# EasyEDA Pro project 天空星拓展板.eprj

# Schematic Schematic1
Board Name: Board1; Create Date: 2025-07-18; Page Name: P1; Project Name: 天空星拓展板; Schematic Name: Schematic1; Update Date: 2025-07-18; Company: 嘉立创EDA; Page Size: A4; Version: V1.0
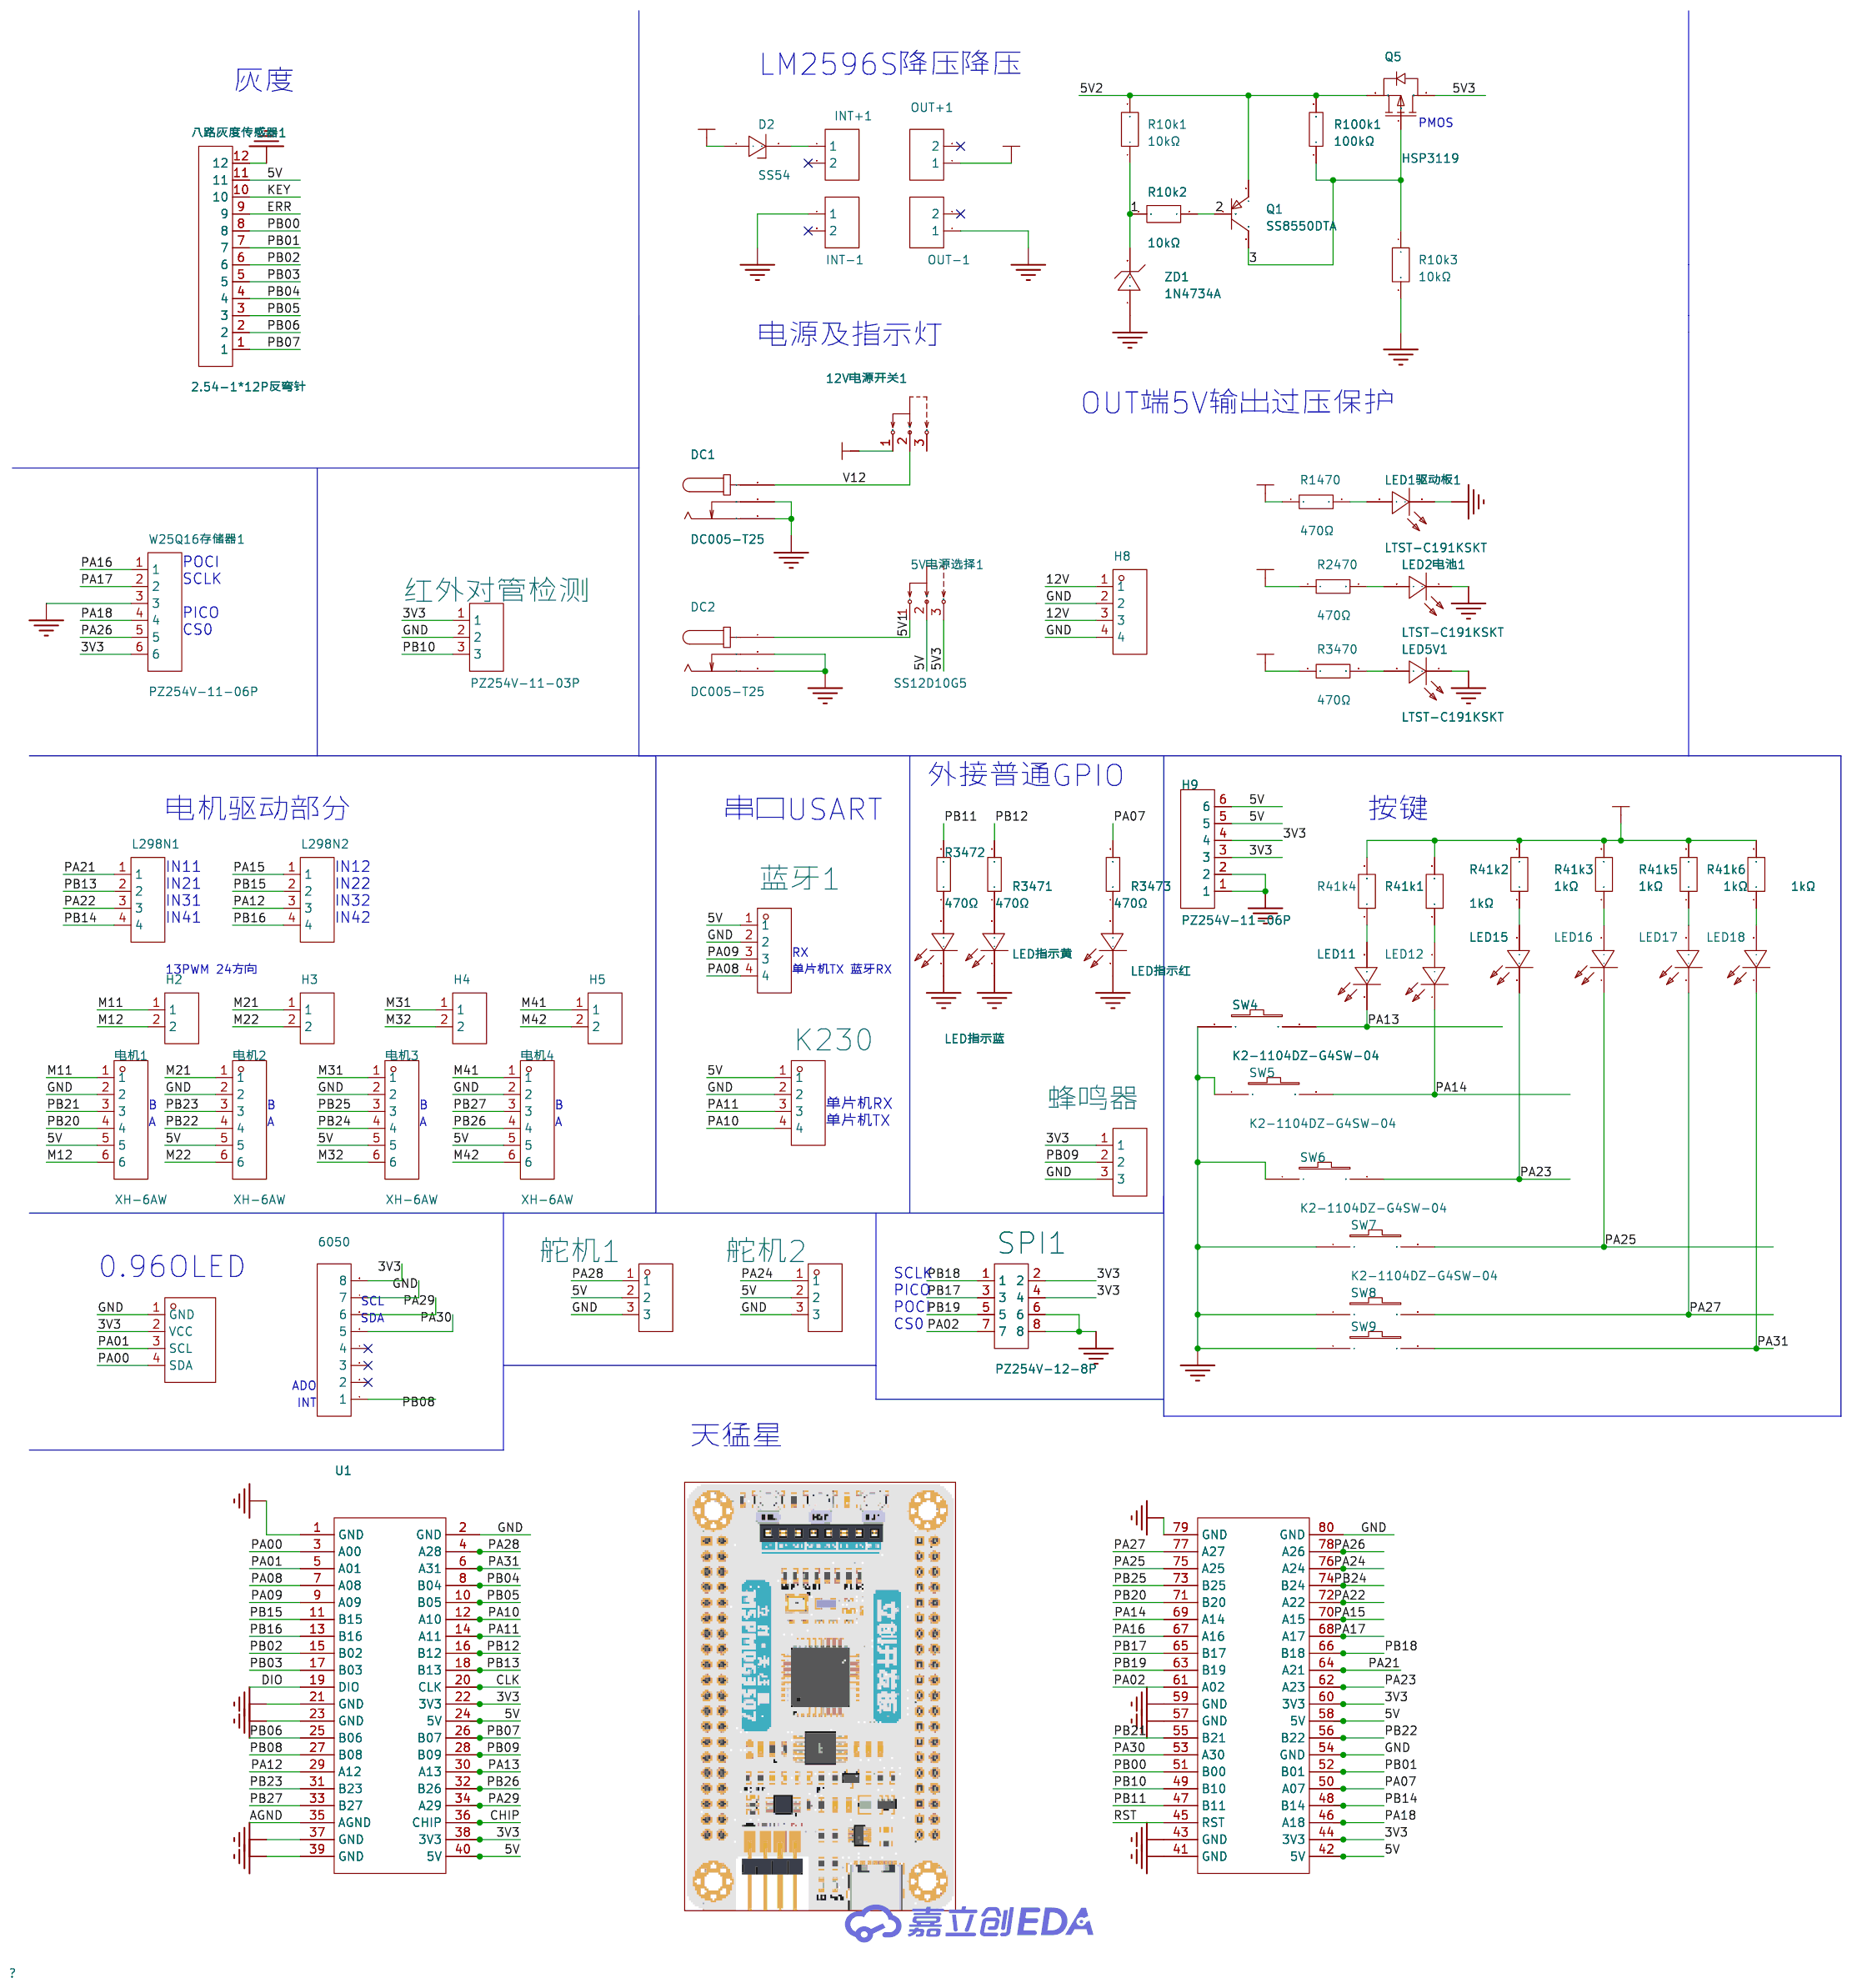
[diagram p0: schematic sheet]

## Parts
5V电源选择1  SS12D10G5  [SW-TH_SHOU-HAN_SS12D10G4]
12V电源开关1  SS12D10G5  [SW-TH_SHOU-HAN_SS12D10G4]
6050  2.54-1*8P母环保  [HDR-TH_8P-P2.54-V-F-1]
D2  SS54  [SMA_L4.3-W2.6-LS5.0-FD]
DC1  DC005-T25  [DC-IN-TH_DC-005-20A-1]
DC2  DC005-T25  [DC-IN-TH_DC-005-20A-1]
H2  PZ254V-11-02P  [HDR-TH_2P-P2.54-V-M]
H3  PZ254V-11-02P  [HDR-TH_2P-P2.54-V-M]
H4  PZ254V-11-02P  [HDR-TH_2P-P2.54-V-M]
H5  PZ254V-11-02P  [HDR-TH_2P-P2.54-V-M]
H8  PZ254V-11-04P  [HDR-TH_4P-P2.54-V-M]
H9  PZ254V-11-06P  [HDR-TH_6P-P2.54-V-M]
INT+1  2.54-1*2P母  [HDR-TH_2P-P2.54-V-F]
INT-1  2.54-1*2P母  [HDR-TH_2P-P2.54-V-F]
K230  PZ254V-11-04P  [HDR-TH_4P-P2.54-V-M]
L298N1  2.54-1*4  [HDR-TH_4P-P2.54-V-M-1]
L298N2  2.54-1*4  [HDR-TH_4P-P2.54-V-M-1]
LED1驱动板1  LTST-C191KSKT  [LED0603-RD-YELLOW]
LED2电池1  LTST-C191KSKT  [LED0603-RD-YELLOW]
LED5V1  LTST-C191KSKT  [LED0603-RD-YELLOW]
LED11  LTST-C191KSKT  [LED0603-RD-YELLOW]
LED12  LTST-C191KSKT  [LED0603-RD-YELLOW]
LED15  LTST-C191KSKT  [LED0603-RD-YELLOW]
LED16  LTST-C191KSKT  [LED0603-RD-YELLOW]
LED17  LTST-C191KSKT  [LED0603-RD-YELLOW]
LED18  LTST-C191KSKT  [LED0603-RD-YELLOW]
LED指示红  LTST-C191KSKT  [LED0603-RD-YELLOW]
LED指示蓝  LTST-C191KSKT  [LED0603-RD-YELLOW]
LED指示黄  LTST-C191KSKT  [LED0603-RD-YELLOW]
OLED1  HS96L03W2C03  [OLED-TH_L27.8-W27.2-P2.54_C9900033791]
OUT+1  2.54-1*2P母  [HDR-TH_2P-P2.54-V-F]
OUT-1  2.54-1*2P母  [HDR-TH_2P-P2.54-V-F]
Q1  SS8550DTA  [TO-92-3_L4.8-W3.7-P2.54-L]
Q5  HSP3119  [TO-220-3_L10.2-W4.5-P2.54-L-1]
R10k1  10kΩ  [RES-TH_BD2.4-L6.3-P10.30-D0.6]
R10k2  10kΩ  [RES-TH_BD2.4-L6.3-P10.30-D0.6]
R10k3  10kΩ  [RES-TH_BD2.4-L6.3-P10.30-D0.6]
R41k1  1kΩ  [R0603]
R41k2  1kΩ  [R0603]
R41k3  1kΩ  [R0603]
R41k4  1kΩ  [R0603]
R41k5  1kΩ  [R0603]
R41k6  1kΩ  [R0603]
R100k1  100kΩ  [RES-TH_BD2.7-L6.2-P10.20-D0.4]
R1470  470Ω  [R0603]
R2470  470Ω  [R0603]
R3470  470Ω  [R0603]
R3471  470Ω  [R0603]
R3472  470Ω  [R0603]
R3473  470Ω  [R0603]
SPI1  PZ254V-12-8P  [HDR-TH_8P-P2.54-V-M-R2-C4-S2.54]
SW4  K2-1104DZ-G4SW-04  [KEY-TH_2P-L6.0-W6.0-P5.00]
SW5  K2-1104DZ-G4SW-04  [KEY-TH_2P-L6.0-W6.0-P5.00]
SW6  K2-1104DZ-G4SW-04  [KEY-TH_2P-L6.0-W6.0-P5.00]
SW7  K2-1104DZ-G4SW-04  [KEY-TH_2P-L6.0-W6.0-P5.00]
SW8  K2-1104DZ-G4SW-04  [KEY-TH_2P-L6.0-W6.0-P5.00]
SW9  K2-1104DZ-G4SW-04  [KEY-TH_2P-L6.0-W6.0-P5.00]
U1  LCKFB-TMX-MSPM0G3507  [COMM-TH_LCKFB-TMX-MSPM0G3507]
W25Q16存储器1  PZ254V-11-06P  [HDR-TH_6P-P2.54-V-M]
ZD1  1N4734A  [DO-41_BD2.8-L4.2-P8.00-D0.7-FD]
八路灰度传感器1  2.54-1*12P反弯针  [HDR-TH_12P-P2.54-H-M-W10.5]
电机1  XH-6AW  [CONN-TH_6P-P2.54_HCTL_XH-6AW_C2908615]
电机2  XH-6AW  [CONN-TH_6P-P2.54_HCTL_XH-6AW_C2908615]
电机3  XH-6AW  [CONN-TH_6P-P2.54_HCTL_XH-6AW_C2908615]
电机4  XH-6AW  [CONN-TH_6P-P2.54_HCTL_XH-6AW_C2908615]
红外对管检测  PZ254V-11-03P  [HDR-TH_3P-P2.54-V-M]
舵机1  舵机  [HDR-TH_3P-P2.54-V-F]
舵机2  舵机  [HDR-TH_3P-P2.54-V-F]
蓝牙1  2.54-1*4P母  [HDR-TH_4P-P2.54-V-F]
蜂鸣器  PZ254V-11-03P  [HDR-TH_3P-P2.54-V-M]

## Library data of the parts
5V电源选择1 12V电源开关1 = SS12D10G5: 电路结构:单刀双掷;安装方式:直插;额定电流(DC):2A;额定电压(DC):125V;机械寿命:3千次;; LCSC Part Name: 两档立式插件 3脚拨动开关 柄长5.0mm; Supplier Part: C7431054; Manufacturer: SHOU HAN(首韩); Supplier Footprint: 插件; JLCPCB Part Class: 扩展库; Datasheet: https://atta.szlcsc.com/upload/public/pdf/source/20231130/7A3DB6A149BF0A1DCFFE64FFC07FE434.pdf; Supplier: LCSC; Circuit: 单刀双掷; Switch Length: 12.7mm; Switch Width: 6.7mm; Mounting Style: 直插; Current Rating (DC): 2A; Voltage Rating (DC): 125V; Mechanical Life: 3千次; Operating Temperature: -25℃~+70℃
6050 = 2.54-1*8P母环保: 插孔结构:1x8P;间距:2.54mm;行距:-;安装类型:直插;排数:单排;总孔位数:8P;塑高:-;触头材质:-;触头镀层:-;; LCSC Part Name: 间距:2.54mm 1x8P 直插; Supplier Part: C27438; Manufacturer: BOOMELE(博穆精密); Supplier Footprint: 插件,P=2.54mm; JLCPCB Part Class: 扩展库; Datasheet: https://atta.szlcsc.com/upload/public/pdf/source/20231221/1CA800C6799ED97958773716FAA1BFFE.pdf; Supplier: LCSC; Holes Structure: 1x8P; Pitch: 2.54mm; Mounting Type: 直插; Number of Rows: 单排; Number of Holes: 8P
D2 = SS54_C7420369: 二极管配置:独立式;正向压降(Vf):550mV@5.0A;直流反向耐压(Vr):40V;整流电流:5A;; LCSC Part Name: 电压:40V 电流:5A; Supplier Part: C7420369; Manufacturer: 宏迦橙; Supplier Footprint: SMA(DO-214AC); JLCPCB Part Class: 扩展库; Datasheet: https://atta.szlcsc.com/upload/public/pdf/source/20230828/254C3882F8647358AD9F60DD73611B5E.pdf; Supplier: LCSC; Diode Configuration: 独立式; Forward Voltage (Vf@If): 550mV@5.0A; Reverse Voltage (Vr): 40V; Rectified Current: 5A; Reverse Leakage Current (Ir): 50uA@40V
DC1 DC2 = DC005-T25: 触点内径:2.5mm;触点外径:6.3mm;额定电流:-;额定电压:-;; LCSC Part Name: 内径:2.5mm 外径:6.3mm; Supplier Part: C111573; Manufacturer: SOFNG(硕方); Supplier Footprint: 插件; JLCPCB Part Class: 扩展库; Datasheet: https://atta.szlcsc.com/upload/public/pdf/source/20211217/AAF92010038535095742900872F779AE.pdf; Supplier: LCSC; Inside Contact Diameter: 2.5mm; Outside Contact Diameter: 6.3mm
H2-H5 = PZ254V-11-02P: 插针结构:1x2P;间距:2.54mm;行距:-;圆针/方针:方针;安装方式:直插;排数:单排;总PIN位数:2P;额定电流:-;额定电压:-;配合针长度:6mm;塑高:2.5mm;端接针长度:3mm;触头材质:黄铜;触头镀层:-;工作温度:-40℃~+105℃;颜色:黑色;; LCSC Part Name: 1x2P 间距:2.54mm 方针 直插; Supplier Part: C492401; Manufacturer: XFCN(兴飞); Supplier Footprint: 插件,P=2.54mm; JLCPCB Part Class: 扩展库; Datasheet: https://atta.szlcsc.com/upload/public/pdf/source/20200309/C492401_A812433581A9B211A7FFA413ADDFF0E5.pdf; Supplier: LCSC; Pin Structure: 1x2P; Pitch: 2.54mm; Circluar Pins/Square Pins: 方针; Mounting Type: 直插; Number of Rows: 单排; Number of Pins: 2P; Length of Mating Pin: 6mm; Insulation Height: 2.5mm; Length of End Connection Pin: 3mm; Contact Material: 黄铜; Operating Temperature: -40℃~+105℃; Color: 黑色
H8 K230 = PZ254V-11-04P: 插针结构:1x4P;间距:2.54mm;行距:-;圆针/方针:方针;安装类型:直插;排数:单排;总PIN位数:4P;额定电流:3A;额定电压:250V;配合针长度:6mm;塑高:2.5mm;端接针长度:3mm;触头材质:-;工作温度范围:-40℃~+105℃;颜色:黑色;; LCSC Part Name: 间距:2.54mm 1x4P 直插 方针; Supplier Part: C2691448; Manufacturer: XFCN(兴飞); Supplier Footprint: 插件,P=2.54mm; JLCPCB Part Class: 扩展库; Datasheet: https://atta.szlcsc.com/upload/public/pdf/source/20200309/C492403_F9F19131791D08044AD4F84F8E751A34.pdf; Supplier: LCSC; Pin Structure: 1x4P; Pitch: 2.54mm; Circluar Pins/Square Pins: 方针; Mounting Type: 直插; Number of Rows: 单排; Number of Pins: 4P; Current Rating (Max): 3A; Voltage Rating (Max): 250V; Length of Mating Pin: 6mm; Insulation Height: 2.5mm; Length of End Connection Pin: 3mm; Operating Temperature Range: -40℃~+105℃; Color: 黑色
H9 W25Q16存储器1 = PZ254V-11-06P: 插针结构:1x6P;间距:2.54mm;行距:-;圆针/方针:方针;安装方式:直插;排数:单排;总PIN位数:6P;额定电流:-;额定电压:-;配合针长度:6mm;塑高:2.5mm;端接针长度:3mm;触头材质:黄铜;触头镀层:-;工作温度:-40℃~+105℃;颜色:黑色;; LCSC Part Name: 1x6P 间距:2.54mm 方针 直插; Supplier Part: C492405; Manufacturer: XFCN(兴飞); Supplier Footprint: 插件,P=2.54mm; JLCPCB Part Class: 扩展库; Datasheet: https://atta.szlcsc.com/upload/public/pdf/source/20200309/C492405_597F1930F5B55CC3C7FD95458F1C3977.pdf; Supplier: LCSC; Pin Structure: 1x6P; Pitch: 2.54mm; Circluar Pins/Square Pins: 方针; Mounting Type: 直插; Number of Rows: 单排; Number of Pins: 6P; Length of Mating Pin: 6mm; Insulation Height: 2.5mm; Length of End Connection Pin: 3mm; Contact Material: 黄铜; Operating Temperature: -40℃~+105℃; Color: 黑色
INT+1 INT-1 OUT+1 OUT-1 = 2.54-1*2P母: 插孔结构:1x2P;间距:2.54mm;行距:-;安装类型:直插;排数:单排;总孔位数:2P;塑高:-;触头材质:-;触头镀层:-;; LCSC Part Name: 间距:2.54mm 1x2P 直插; Supplier Part: C49661; Manufacturer: BOOMELE(博穆精密); Supplier Footprint: 插件,P=2.54mm; JLCPCB Part Class: 扩展库; Datasheet: https://atta.szlcsc.com/upload/public/pdf/source/20210301/C2718488_F4427B881E42CAA8DDB0B1C12B3A522C.pdf; Supplier: LCSC; Holes Structure: 1x2P; Pitch: 2.54mm; Mounting Type: 直插; Number of Rows: 单排; Number of Holes: 2P
L298N1 L298N2 = 2.54-1*4: 插针结构:1x4P;间距:2.54mm;排数:单排;总PIN位数:4P;; Supplier Part: C5116483; Manufacturer: ZHOURI(洲日); Supplier Footprint: 插件,P=2.54mm; JLCPCB Part Class: 扩展库; Datasheet: https://atta.szlcsc.com/upload/public/pdf/source/20250227/F941FC765EF241ABFB2D5D72948A31A5.pdf; Supplier: LCSC; Pin Structure: 1x4P; Pitch: 2.54mm; Number of Rows: 单排; Number of Pins: 4P
LED1驱动板1 LED2电池1 LED5V1 LED11 LED12 LED15-LED18 LED指示红 LED指示蓝 LED指示黄 = LTST-C191KSKT: 发光颜色:黄色;正向电压(VF):2.1V;功率:75mW;正向电流:20mA;主波长:584.5nm~597nm;二极管配置:-;透镜颜色:无色透明透镜;色温:-;发光强度:104mcd;发光角度:130°;载带方式:-;工作温度:-55℃~+85℃;; LCSC Part Name: 黄灯; Supplier Part: C125100; Manufacturer: LITEON(光宝); Supplier Footprint: 0603; JLCPCB Part Class: 扩展库; Datasheet: https://atta.szlcsc.com/upload/public/pdf/source/20180129/C125100_15171877314981315871.pdf; Supplier: LCSC; Emitted Color: 黄色; Forward Voltage (VF): 2.1V; Power Dissipation: 75mW; Forward Current: 20mA; Dominant Wavelength: 584.5nm~597nm; Peak Wavelength: 588nm; Lens Color: 无色透明透镜; Luminous Intensity: 104mcd; Viewing Angle: 130°; Operating Temperature: -55℃~+85℃
OLED1 = HS96L03W2C03: 主控芯片:SSD1315;接口类型:I2C;尺寸(inch):0.96;像素分辨率:128x64;; LCSC Part Name: 0.96寸OLED显示屏窄白光IIC; Supplier Part: C5248080; Manufacturer: HS(汉昇); JLCPCB Part Class: 扩展库; Datasheet: https://atta.szlcsc.com/upload/public/pdf/source/20230627/763D01F79A90007632F098068C7C8AD9.pdf; Supplier: LCSC; Main Control Chip: SSD1315; Interface Type: I2C; Size: 0.96; Pixel Resolution: 128x64; Operating Temperature: -40℃~+70℃
Q1 = SS8550DTA: 晶体管类型:PNP;集电极电流(Ic):1.5A;集射极击穿电压(Vceo):25V;功率(Pd):2W;直流电流增益(hFE@Ic,Vce):40@800mA,1V;; LCSC Part Name: PNP 电流:1.5A 耐压:25V; Supplier Part: C903228; Manufacturer: onsemi(安森美); Supplier Footprint: TO-92-3; JLCPCB Part Class: Extended Part; Datasheet: https://atta.szlcsc.com/upload/public/pdf/source/20221020/9DBCD1C6A257D06DE4F9043ED0140297.pdf; Supplier: LCSC; Transistor Type: PNP; Collector Current (Ic): 1.5A; Collector-Emitter Breakdown Voltage (Vceo): 25V; Power Dissipation (Pd): 2W; DC Current Gain (hFE@Ic,Vce): 40@800mA,1V; Transition Frequency (fT): 100MHz; Collector Cut-Off Current (Icbo): 100nA; Collector-Emitter Saturation Voltage (VCE(sat)@Ic,Ib): 280mV@800mA,80mA; Operating Temperature: -65℃~+150℃
Q5 = HSP3119: 类型:1个P沟道;漏源电压(Vdss):30V;连续漏极电流(Id):150A;导通电阻(RDS(on)):-;耗散功率(Pd):200W;阈值电压(Vgs(th)):2.5V;; LCSC Part Name: 1个P沟道 耐压:30V 电流:150A; Supplier Part: C22359262; Manufacturer: HUASHUO(华朔); Supplier Footprint: TO-220; JLCPCB Part Class: Extended Part; Datasheet: https://atta.szlcsc.com/upload/public/pdf/source/20240313/B2043F85A28365E5AF5F107A9C9B0F2E.pdf; Supplier: LCSC; Type: 1个P沟道; Drain to Source Voltage: 30V; Current - Continuous Drain(Id): 150A; Pd - Power Dissipation: 200W; Gate Threshold Voltage (Vgs(th)@Id): 2.5V; Input Capacitance(Ciss@Vds): 12.7nF@15V; Reverse Transfer Capacitance (Crss@Vds): 1.21nF@15V; Operating Temperature: -55℃~+150℃@(Tj)
R10k1-R10k3 = RN1/4W10KFT/BA1: 电阻类型:金属膜电阻;阻值:10kΩ;精度:±1%;功率:250mW;温度系数:±50ppm/℃;; LCSC Part Name: 10kΩ ±1% 250mW 金属膜电阻; Supplier Part: C410695; Manufacturer: Tyohm(幸亚电阻); Supplier Footprint: 插件,D2.4xL6.5mm; JLCPCB Part Class: Extended Part; Datasheet: https://atta.szlcsc.com/upload/public/pdf/source/20190808/C410699_D126E64D28B638F1D73B58E9F61DFD9B.pdf; Supplier: LCSC; Type: 金属膜电阻; Tolerance: ±1%; Overload Voltage (Max): 250V; Power(Watts): 250mW; Temperature Coefficient: ±50ppm/℃; Operating Temperature Range: -55℃~+125℃
R41k1-R41k6 = FCR0603F1K: 电阻类型:厚膜电阻;阻值:1kΩ;精度:±1%;功率:100mW;最大工作电压:75V;; LCSC Part Name: 1K ±1%; Supplier Part: C5913168; Manufacturer: VO(翔胜); Supplier Footprint: 0603; JLCPCB Part Class: 扩展库; Datasheet: https://atta.szlcsc.com/upload/public/pdf/source/20230428/98B65D379E9BA4CF2A9223D1647B01B6.pdf; Supplier: LCSC; Type: 厚膜电阻; Tolerance: ±1%; Power(Watts): 100mW; Overload Voltage (Max): 75V; Operating Temperature Range: -55℃~+155℃
R100k1 = MF1/4W-100K±1%-OT26: 电阻类型:金属膜电阻;阻值:100kΩ;精度:±1%;功率:250mW;温度系数:±350ppm/℃;; LCSC Part Name: 金属膜电阻 100kΩ ±1% 250mW; Supplier Part: C2843019; Manufacturer: VO(翔胜); Supplier Footprint: 插件,D2.7xL6.2mm; JLCPCB Part Class: Extended Part; Datasheet: https://atta.szlcsc.com/upload/public/pdf/source/20200609/C601728_5AA4C0C8E12E11069DA2C3356F29D1F2.pdf; Supplier: LCSC; Type: 金属膜电阻; Tolerance: ±1%; Overload Voltage (Max): 250V; Power(Watts): 250mW; Temperature Coefficient: ±350ppm/℃; Operating Temperature Range: -55℃~+155℃
R1470 R2470 R3470-R3473 = 0603WAF4700T5E: 电阻类型:厚膜电阻;阻值:470Ω;精度:±1%;功率:100mW;最大工作电压:75V;温度系数:±100ppm/℃;; LCSC Part Name: 470Ω ±1% 100mW 厚膜电阻; Supplier Part: C23179; Manufacturer: UNI-ROYAL(厚声); Supplier Footprint: 0603; JLCPCB Part Class: 基础库; Datasheet: https://atta.szlcsc.com/upload/public/pdf/source/20200306/C422600_1E6D84923E4A46A82E41ADD87F860B5C.pdf; Supplier: LCSC; Type: 厚膜电阻; Tolerance: ±1%; Power(Watts): 100mW; Overload Voltage (Max): 75V; Temperature Coefficient: ±100ppm/℃; Operating Temperature Range: -55℃~+155℃
SPI1 = PZ254V-12-8P: 插针结构:2x4P;间距:2.54mm;行距:2.54mm;圆针/方针:方针;安装方式:直插;排数:双排;总PIN位数:8P;额定电流:-;额定电压:-;配合针长度:6mm;塑高:2.5mm;端接针长度:3mm;触头材质:黄铜;触头镀层:-;工作温度:-40℃~+105℃;颜色:黑色;; LCSC Part Name: 2x4P 间距:2.54mm 方针 直插; Supplier Part: C492421; Manufacturer: XFCN(兴飞); Supplier Footprint: 插件,P=2.54mm; JLCPCB Part Class: 扩展库; Datasheet: https://atta.szlcsc.com/upload/public/pdf/source/20200309/C492421_DC8A206AF99CD7755BD4A5B0BC48200B.pdf; Supplier: LCSC; Pin Structure: 2x4P; Pitch: 2.54mm; Row Spacing: 2.54mm; Circluar Pins/Square Pins: 方针; Mounting Type: 直插; Number of Rows: 双排; Number of Pins: 8P; Length of Mating Pin: 6mm; Insulation Height: 2.5mm; Length of End Connection Pin: 3mm; Contact Material: 黄铜; Operating Temperature: -40℃~+105℃; Color: 黑色
SW4-SW9 = K2-1104DZ-G4SW-04: 作用力:250gf;安装方式:直插;开关长度:6mm;开关宽度:6mm;开关高度:7mm;触点电流:50mA;额定电压(DC):12V;绝缘电阻:100MΩ;机械寿命:10万次;; LCSC Part Name: 6*6*7 两脚长脚开关; Supplier Part: C961736; Manufacturer: 韩国韩荣; Supplier Footprint: 插件; JLCPCB Part Class: 扩展库; Datasheet: https://atta.szlcsc.com/upload/public/pdf/source/20201126/C961736_4F85C6E6E5B3656D5DC7C0B00D034F4A.pdf; Supplier: LCSC; Operating Force: 250gf; Mounting Style: 直插; Switch Length: 6mm; Switch Width: 6mm; Switch Height: 7mm; Contact Current: 50mA; Voltage Rating (DC): 12V; Insulation Resistance: 100MΩ; Mechanical Life: 10万次; Operating Temperature: -25℃~+85℃
U1 = LCKFB-TMX-MSPM0G3507: LCSC Part Name: 5件套 立创·天猛星MSPM0G3507开发板; Supplier Part: C42378531; Manufacturer: 立创开发板; Datasheet: https://atta.szlcsc.com/upload/public/pdf/source/20241209/800332349277522348D9357AB5109808.pdf; Supplier: LCSC
ZD1 = 1N4734A_C41430: 二极管配置:独立式;稳压值(标称值):5.6V;耗散功率(Pd):-;; LCSC Part Name: 编带 1N4734A; Supplier Part: C41430; Manufacturer: ST(先科); Supplier Footprint: DO-41; JLCPCB Part Class: Extended Part; Datasheet: https://atta.szlcsc.com/upload/public/pdf/source/20170719/C118641_1500457766301828347.pdf; Supplier: LCSC; Diode Configuration: 独立式; Zener Voltage(Nom): 5.6V; Reverse Leakage Current (Ir): 10uA@2V; Impedance(Zzt): 5Ω
八路灰度传感器1 = 2.54-1*12P反弯针_C725243: 插针结构:1x12P;间距:2.54mm;行距:-;圆针/方针:方针;安装方式:弯插;排数:单排;总PIN位数:12P;额定电流:3A;额定电压:-;配合针长度:6mm;塑高:-;端接针长度:-;触头材质:-;工作温度:-55℃~+105℃;颜色:黑色;; LCSC Part Name: 1x12P 间距:2.54mm 方针 弯插; Supplier Part: C725243; Manufacturer: BOOMELE(博穆精密); Supplier Footprint: 弯插,P=2.54mm; JLCPCB Part Class: 扩展库; Datasheet: https://atta.szlcsc.com/upload/public/pdf/source/20190508/C74252_03DDEC4696EE17172E44B96636392962.pdf; Supplier: LCSC; Pin Structure: 1x12P; Pitch: 2.54mm; Circluar Pins/Square Pins: 方针; Mounting Type: 弯插; Number of Rows: 单排; Number of Pins: 12P; Current Rating: 3A; Length of Mating Pin: 6mm; Operating Temperature: -55℃~+105℃; Color: 黑色
电机1-电机4 = XH-6AW: 插针结构:1x6P;间距:2.5mm;安装方式:弯插;参考系列:XH;总PIN数:6P;排数:1;每排PIN数:6;行距:-;额定电流:3A;触头材质:黄铜;触头镀层:锡;工作温度范围:-25℃~+85℃;; LCSC Part Name: 1x6P 间距:2.5mm 弯插 系列:XH; Supplier Part: C2908615; Manufacturer: HCTL(华灿天禄); Supplier Footprint: 弯插,P=2.5mm; JLCPCB Part Class: 扩展库; Datasheet: https://atta.szlcsc.com/upload/public/pdf/source/20230711/B565BAF3B11666EF6B81B3605408F2BD.pdf; Supplier: LCSC; Pins Structure: 1x6P; Pitch: 2.5mm; Mounting Style: 弯插; Reference Series: XH; Number of Pins: 6P; Number of Rows: 1; Number of PINs Per Row: 6; Current Rating (Max): 3A; Contact Material: 黄铜; Contact Plating: 锡; Operating Temperature Range: -25℃~+85℃
红外对管检测 蜂鸣器 = PZ254V-11-03P: 插针结构:1x3P;间距:2.54mm;行距:-;圆针/方针:方针;安装方式:直插;排数:单排;总PIN位数:3P;额定电流:3A;额定电压:250V;配合针长度:6mm;塑高:2.5mm;端接针长度:3mm;工作温度:-40℃~+105℃;颜色:黑色;; LCSC Part Name: 1x3P 间距:2.54mm 方针 直插; Supplier Part: C2937625; Manufacturer: XFCN(兴飞); Supplier Footprint: 插件,P=2.54mm; JLCPCB Part Class: 扩展库; Datasheet: https://atta.szlcsc.com/upload/public/pdf/source/20200309/C492402_8335C3D49C4E4C618838D59BB1D024C1.pdf; Supplier: LCSC; Pin Structure: 1x3P; Pitch: 2.54mm; Circluar Pins/Square Pins: 方针; Mounting Type: 直插; Number of Rows: 单排; Number of Pins: 3P; Current Rating: 3A; Voltage Rating (Max): 250V; Length of Mating Pin: 6mm; Insulation Height: 2.5mm; Length of End Connection Pin: 3mm; Operating Temperature: -40℃~+105℃; Color: 黑色
舵机1 舵机2 = PM254V-11-03-H85: 插孔结构:1x3P;间距:2.54mm;行距:-;安装类型:直插;排数:单排;总孔位数:3P;塑高:-;触头材质:黄铜;触头镀层:-;; LCSC Part Name: 间距:2.54mm 1x3P 直插; Supplier Part: C541850; Manufacturer: XFCN(兴飞); Supplier Footprint: 插件,P=2.54mm; JLCPCB Part Class: 扩展库; Datasheet: https://atta.szlcsc.com/upload/public/pdf/source/20200518/C541849_85853D71FC67C51915A806977A588FDA.pdf; Supplier: LCSC; Holes Structure: 1x3P; Pitch: 2.54mm; Mounting Type: 直插; Number of Rows: 单排; Number of Holes: 3P; Contact Material: 黄铜
蓝牙1 = 2.54-1*4P母: 插孔结构:1x4P;间距:2.54mm;行距:-;圆孔/方孔:方孔;安装类型:直插;排数:单排;总孔位数:4P;额定电流:3A;额定电压:-;插孔方向:顶部;塑高:-;触头材质:青铜;触头镀层:-;工作温度范围:-40℃~+105℃;焊接温度(最大值):-;; LCSC Part Name: 间距:2.54mm 1x4P 直插; Supplier Part: C2718488; Manufacturer: BOOMELE(博穆精密); Supplier Footprint: 插件,P=2.54mm; JLCPCB Part Class: 扩展库; Datasheet: https://atta.szlcsc.com/upload/public/pdf/source/20210301/C2718488_F4427B881E42CAA8DDB0B1C12B3A522C.pdf; Supplier: LCSC; Holes Structure: 1x4P; Pitch: 2.54mm; Circular Hole / Square Hole: 方孔; Mounting Type: 直插; Number of Rows: 单排; Number of Holes: 4P; Current Rating (Max): 3A; Holes Direction: 顶部; Contact Material: 青铜; Operating Temperature Range: -40℃~+105℃

## Nets
3V3: 6050.8 H9.3 H9.4 OLED1.2(VCC) R41k1.2 R41k2.2 R41k3.2 R41k4.2 R41k5.2 R41k6.2 R2470.1 SPI1.2 SPI1.4 U1.22(3V3) U1.38(3V3) U1.44(3V3) U1.60(3V3) W25Q16存储器1.6 红外对管检测.1 蜂鸣器.1
5V: 5V电源选择1.2 H9.5 H9.6 K230.1 R3470.1 U1.24(5V) U1.40(5V) U1.42(5V) U1.58(5V) 八路灰度传感器1.11 电机1.5 电机2.5 电机3.5 电机4.5 舵机1.2 舵机2.2 蓝牙1.1
5V1: 5V电源选择1.1 DC2.1
5V2: OUT+1.1 Q1.1(E) Q5.3(S) R10k1.2 R100k1.2
5V3: 5V电源选择1.3 Q5.2(D)
12V: 12V电源开关1.1 D2.1(A) H8.1 H8.3 R1470.1
AGND: U1.35(AGND)
GND: 6050.7 DC1.2 DC1.3 DC2.2 DC2.3 H8.2 H8.4 H9.1 H9.2 INT-1.1 K230.2 LED1驱动板1.1(-) LED2电池1.1(-) LED5V1.1(-) LED指示红.1(-) LED指示蓝.1(-) LED指示黄.1(-) OLED1.1(GND) OUT-1.1 R10k3.2 SPI1.6 SPI1.8 SW4.1 SW5.1 SW6.1 SW7.1 SW8.1 SW9.1 U1.1(GND) U1.2(GND) U1.21(GND) U1.23(GND) U1.37(GND) U1.39(GND) U1.41(GND) U1.43(GND) U1.54(GND) U1.57(GND) U1.59(GND) U1.79(GND) U1.80(GND) W25Q16存储器1.3 ZD1.1(A) 八路灰度传感器1.12 电机1.2 电机2.2 电机3.2 电机4.2 红外对管检测.2 舵机1.3 舵机2.3 蓝牙1.2 蜂鸣器.3
V12: 12V电源开关1.2 DC1.1
1: R10k1.1 R10k2.2 ZD1.2(K)
2: Q1.2(B) R10k2.1
3: Q1.3(C) Q5.1(G) R10k3.1 R100k1.1
CHIP: U1.36(CHIP)
CLK: U1.20(CLK)
DIO: U1.19(DIO)
ERR: 八路灰度传感器1.9
KEY: 八路灰度传感器1.10
M11: H2.1 电机1.1
M12: H2.2 电机1.6
M21: H3.1 电机2.1
M22: H3.2 电机2.6
M31: H4.1 电机3.1
M32: H4.2 电机3.6
M41: H5.1 电机4.1
M42: H5.2 电机4.6
PA00: OLED1.4(SDA) U1.3(A00)
PA01: OLED1.3(SCL) U1.5(A01)
PA02: SPI1.7 U1.61(A02)
PA07: R3473.2 U1.50(A07)
PA08: U1.7(A08) 蓝牙1.4
PA09: U1.9(A09) 蓝牙1.3
PA10: K230.4 U1.12(A10)
PA11: K230.3 U1.14(A11)
PA12: L298N2.3 U1.29(A12)
PA13: LED11.1(-) SW4.2 U1.30(A13)
PA14: LED12.1(-) SW5.2 U1.69(A14)
PA15: L298N2.1 U1.70(A15)
PA16: U1.67(A16) W25Q16存储器1.1
PA17: U1.68(A17) W25Q16存储器1.2
PA18: U1.46(A18) W25Q16存储器1.4
PA21: L298N1.1 U1.64(A21)
PA22: L298N1.3 U1.72(A22)
PA23: LED15.1(-) SW6.2 U1.62(A23)
PA24: U1.76(A24) 舵机2.1
PA25: LED16.1(-) SW7.2 U1.75(A25)
PA26: U1.78(A26) W25Q16存储器1.5
PA27: LED17.1(-) SW8.2 U1.77(A27)
PA28: U1.4(A28) 舵机1.1
PA29: 6050.6 U1.34(A29)
PA30: 6050.5 U1.53(A30)
PA31: LED18.1(-) SW9.2 U1.6(A31)
PB00: U1.51(B00) 八路灰度传感器1.8
PB01: U1.52(B01) 八路灰度传感器1.7
PB02: U1.15(B02) 八路灰度传感器1.6
PB03: U1.17(B03) 八路灰度传感器1.5
PB04: U1.8(B04) 八路灰度传感器1.4
PB05: U1.10(B05) 八路灰度传感器1.3
PB06: U1.25(B06) 八路灰度传感器1.2
PB07: U1.26(B07) 八路灰度传感器1.1
PB08: 6050.1 U1.27(B08)
PB09: U1.28(B09) 蜂鸣器.2
PB10: U1.49(B10) 红外对管检测.3
PB11: R3472.2 U1.47(B11)
PB12: R3471.2 U1.16(B12)
PB13: L298N1.2 U1.18(B13)
PB14: L298N1.4 U1.48(B14)
PB15: L298N2.2 U1.11(B15)
PB16: L298N2.4 U1.13(B16)
PB17: SPI1.3 U1.65(B17)
PB18: SPI1.1 U1.66(B18)
PB19: SPI1.5 U1.63(B19)
PB20: U1.71(B20) 电机1.4
PB21: U1.55(B21) 电机1.3
PB22: U1.56(B22) 电机2.4
PB23: U1.31(B23) 电机2.3
PB24: U1.74(B24) 电机3.4
PB25: U1.73(B25) 电机3.3
PB26: U1.32(B26) 电机4.4
PB27: U1.33(B27) 电机4.3
RST: U1.45(RST)
$1N2882: LED5V1.2(+) R3470.2
$1N2893: LED1驱动板1.2(+) R1470.2
$1N2924: LED2电池1.2(+) R2470.2
$1N2928: D2.2(K) INT+1.1
$1N4920: LED11.2(+) R41k4.1
$1N4923: LED12.2(+) R41k1.1
$1N4924: LED15.2(+) R41k2.1
$1N4925: LED16.2(+) R41k3.1
$1N4935: LED17.2(+) R41k5.1
$1N4936: LED18.2(+) R41k6.1
$1N7306: LED指示黄.2(+) R3471.1
$1N7461: LED指示蓝.2(+) R3472.1
$1N7683: LED指示红.2(+) R3473.1

Not connected (* = marked no-connect by the designer): 12V电源开关1 3; 6050 2* 3* 4*; INT+1 2*; INT-1 2*; OUT+1 2*; OUT-1 2*

## Notes on the sheet
- LM2596S降压降压
- 灰度
- PMOS
- 电源及指示灯
- OUT端5V输出过压保护
- POCI
- SCLK
- PICO
- CS0
- 外接普通GPIO
- 电机驱动部分
- 串口USART
- 按键
- IN11
- IN12
- IN21
- IN22
- IN31
- IN32
- IN41
- IN42
- RX
- 13PWM 24方向
- 单片机TX 蓝牙RX
- B
- B
- B
- B
- 单片机RX
- A
- A
- A
- A
- 单片机TX
- 0.96OLED
- SCL
- PICO
- SCLK
- SDA
- POCI
- CS0
- ADO
- INT
- 天猛星

# Schematic Schematic3
Board Name: Board2; Create Date: 2025-07-18; Page Name: P1; Project Name: 天空星拓展板; Schematic Name: Schematic3; Update Date: 2025-07-18; Company: 嘉立创EDA; Page Size: A4; Version: V1.0
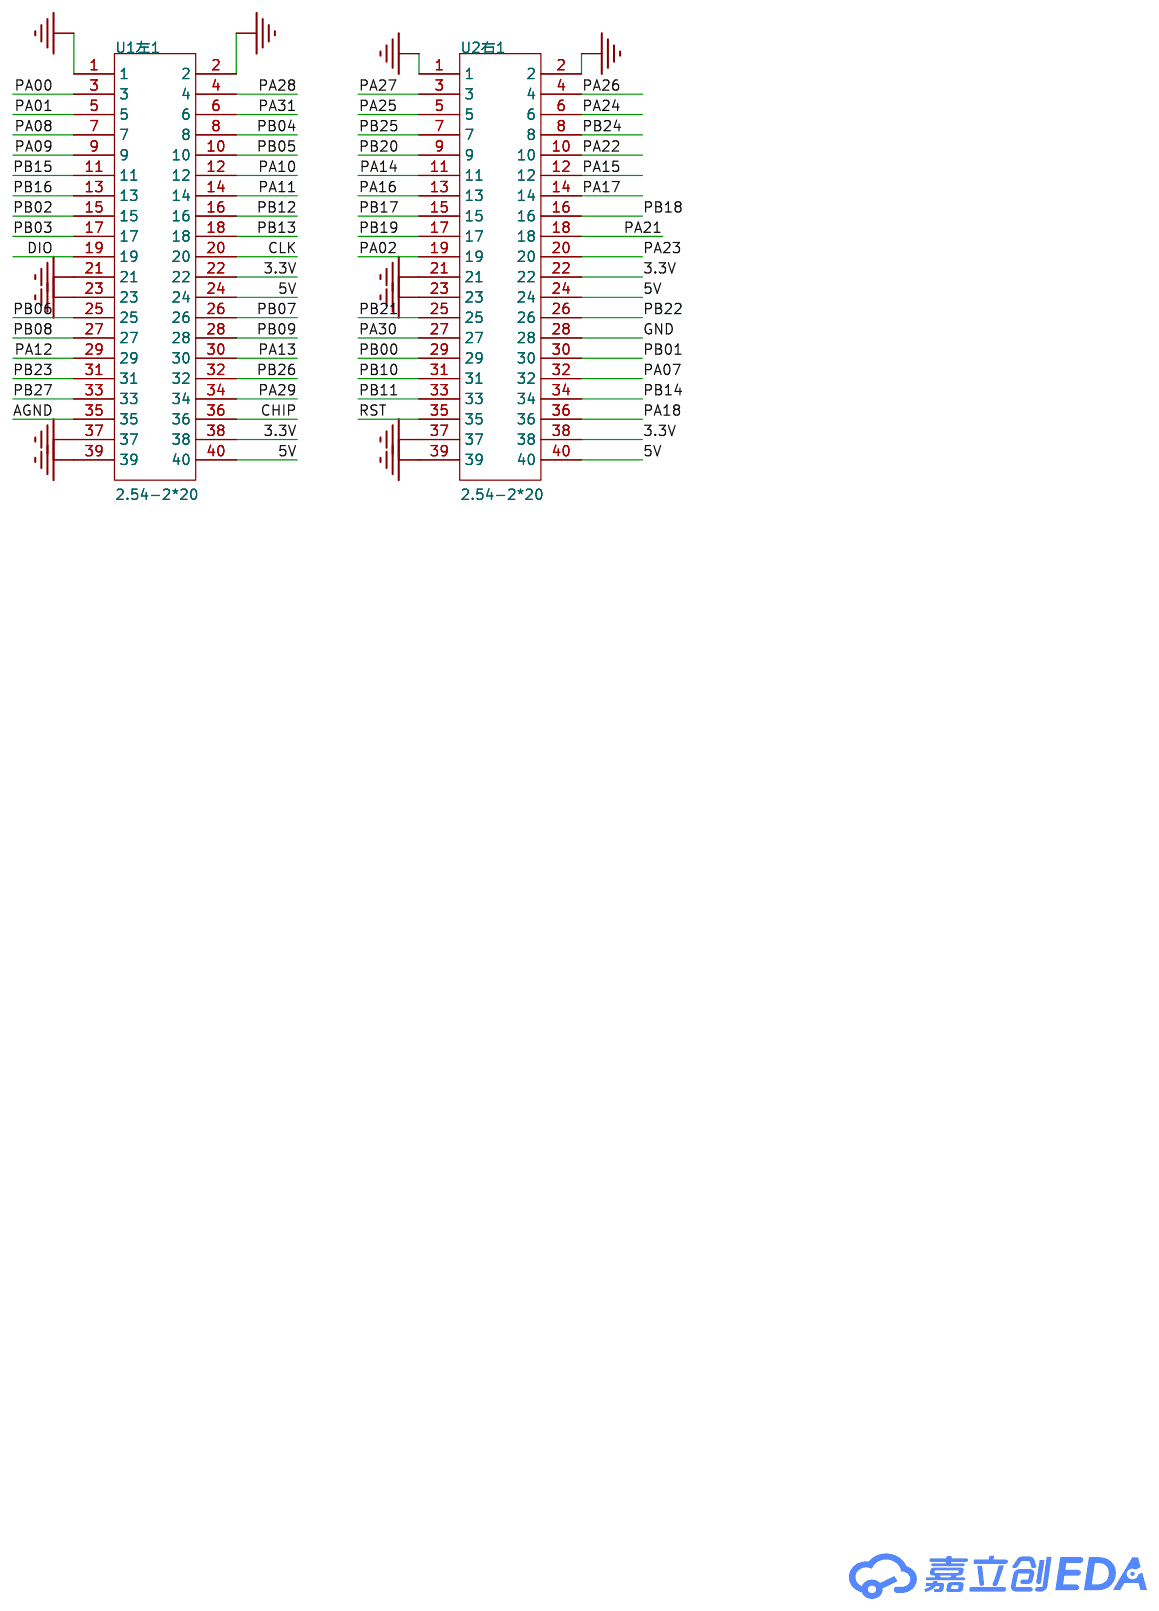
[diagram p1: schematic sheet]

## Parts
U1左1  2.54-2*20  [HDR-TH_40P-P2.54-V-F-R2-C20-S2.54]
U2右1  2.54-2*20  [HDR-TH_40P-P2.54-V-F-R2-C20-S2.54]

## Library data of the parts
U1左1 U2右1 = 2.54-2*20: LCSC Part Name: 间距:2.54mm 2x20P 直插; Supplier Part: C2977589; Manufacturer: ZHOURI(洲日); Supplier Footprint: 插件,P=2.54mm; JLCPCB Part Class: 扩展库; Datasheet: https://atta.szlcsc.com/upload/public/pdf/source/20220328/834E302BE3C038BBC5C70F5E02589B1E.pdf; Supplier: LCSC; Holes Structure: 2x20P; Pitch: 2.54mm; Row Spacing: 2.54mm; Circular Hole / Square Hole: 方孔; Mounting Type: 直插; Number of Rows: 双排; Number of Holes: 40P; Current Rating (Max): 2.5A; Holes Direction: 顶部; Insulation Height: 8.5mm; Operating Temperature Range: -40℃~+105℃

## Nets
3.3V: U1左1.22 U1左1.38 U2右1.22 U2右1.38
5V: U1左1.24 U1左1.40 U2右1.24 U2右1.40
AGND: U1左1.35
GND: U1左1.1 U1左1.2 U1左1.21 U1左1.23 U1左1.37 U1左1.39 U2右1.1 U2右1.2 U2右1.21 U2右1.23 U2右1.28 U2右1.37 U2右1.39
CHIP: U1左1.36
CLK: U1左1.20
DIO: U1左1.19
PA00: U1左1.3
PA01: U1左1.5
PA02: U2右1.19
PA07: U2右1.32
PA08: U1左1.7
PA09: U1左1.9
PA10: U1左1.12
PA11: U1左1.14
PA12: U1左1.29
PA13: U1左1.30
PA14: U2右1.11
PA15: U2右1.12
PA16: U2右1.13
PA17: U2右1.14
PA18: U2右1.36
PA21: U2右1.18
PA22: U2右1.10
PA23: U2右1.20
PA24: U2右1.6
PA25: U2右1.5
PA26: U2右1.4
PA27: U2右1.3
PA28: U1左1.4
PA29: U1左1.34
PA30: U2右1.27
PA31: U1左1.6
PB00: U2右1.29
PB01: U2右1.30
PB02: U1左1.15
PB03: U1左1.17
PB04: U1左1.8
PB05: U1左1.10
PB06: U1左1.25
PB07: U1左1.26
PB08: U1左1.27
PB09: U1左1.28
PB10: U2右1.31
PB11: U2右1.33
PB12: U1左1.16
PB13: U1左1.18
PB14: U2右1.34
PB15: U1左1.11
PB16: U1左1.13
PB17: U2右1.15
PB18: U2右1.16
PB19: U2右1.17
PB20: U2右1.9
PB21: U2右1.25
PB22: U2右1.26
PB23: U1左1.31
PB24: U2右1.8
PB25: U2右1.7
PB26: U1左1.32
PB27: U1左1.33
RST: U2右1.35

# Board PCB1
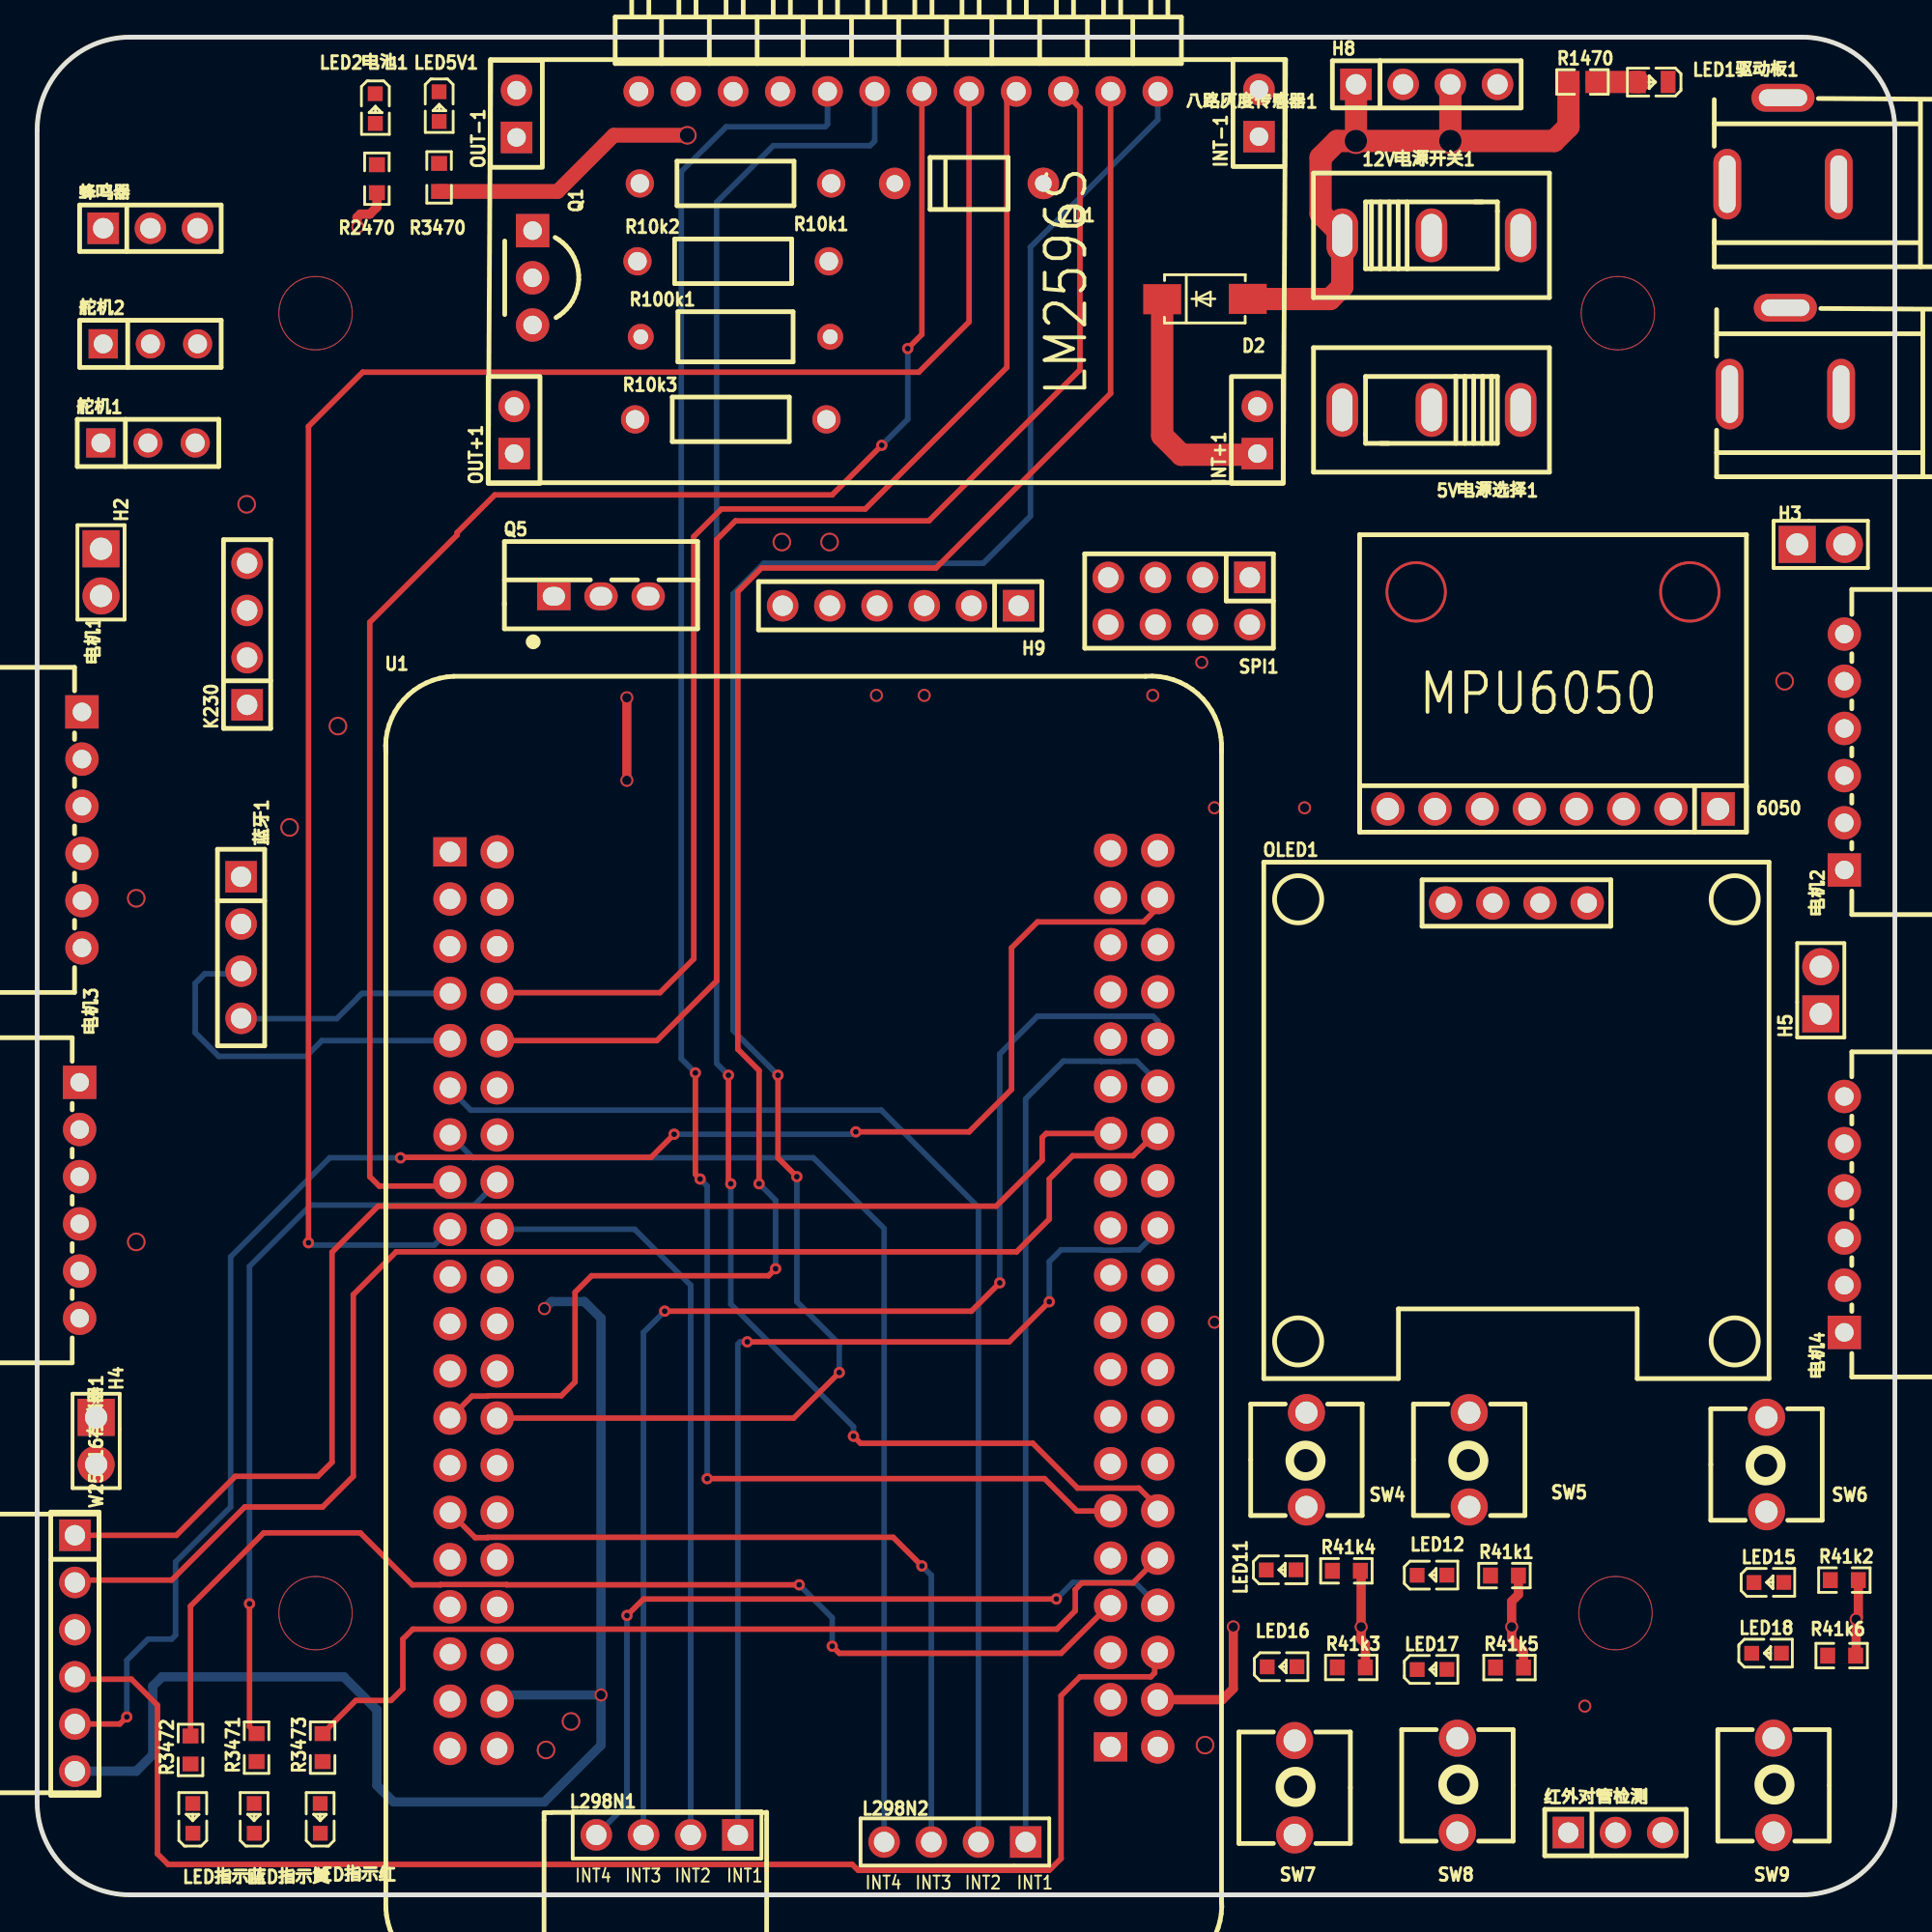
[diagram p2: board, top side]
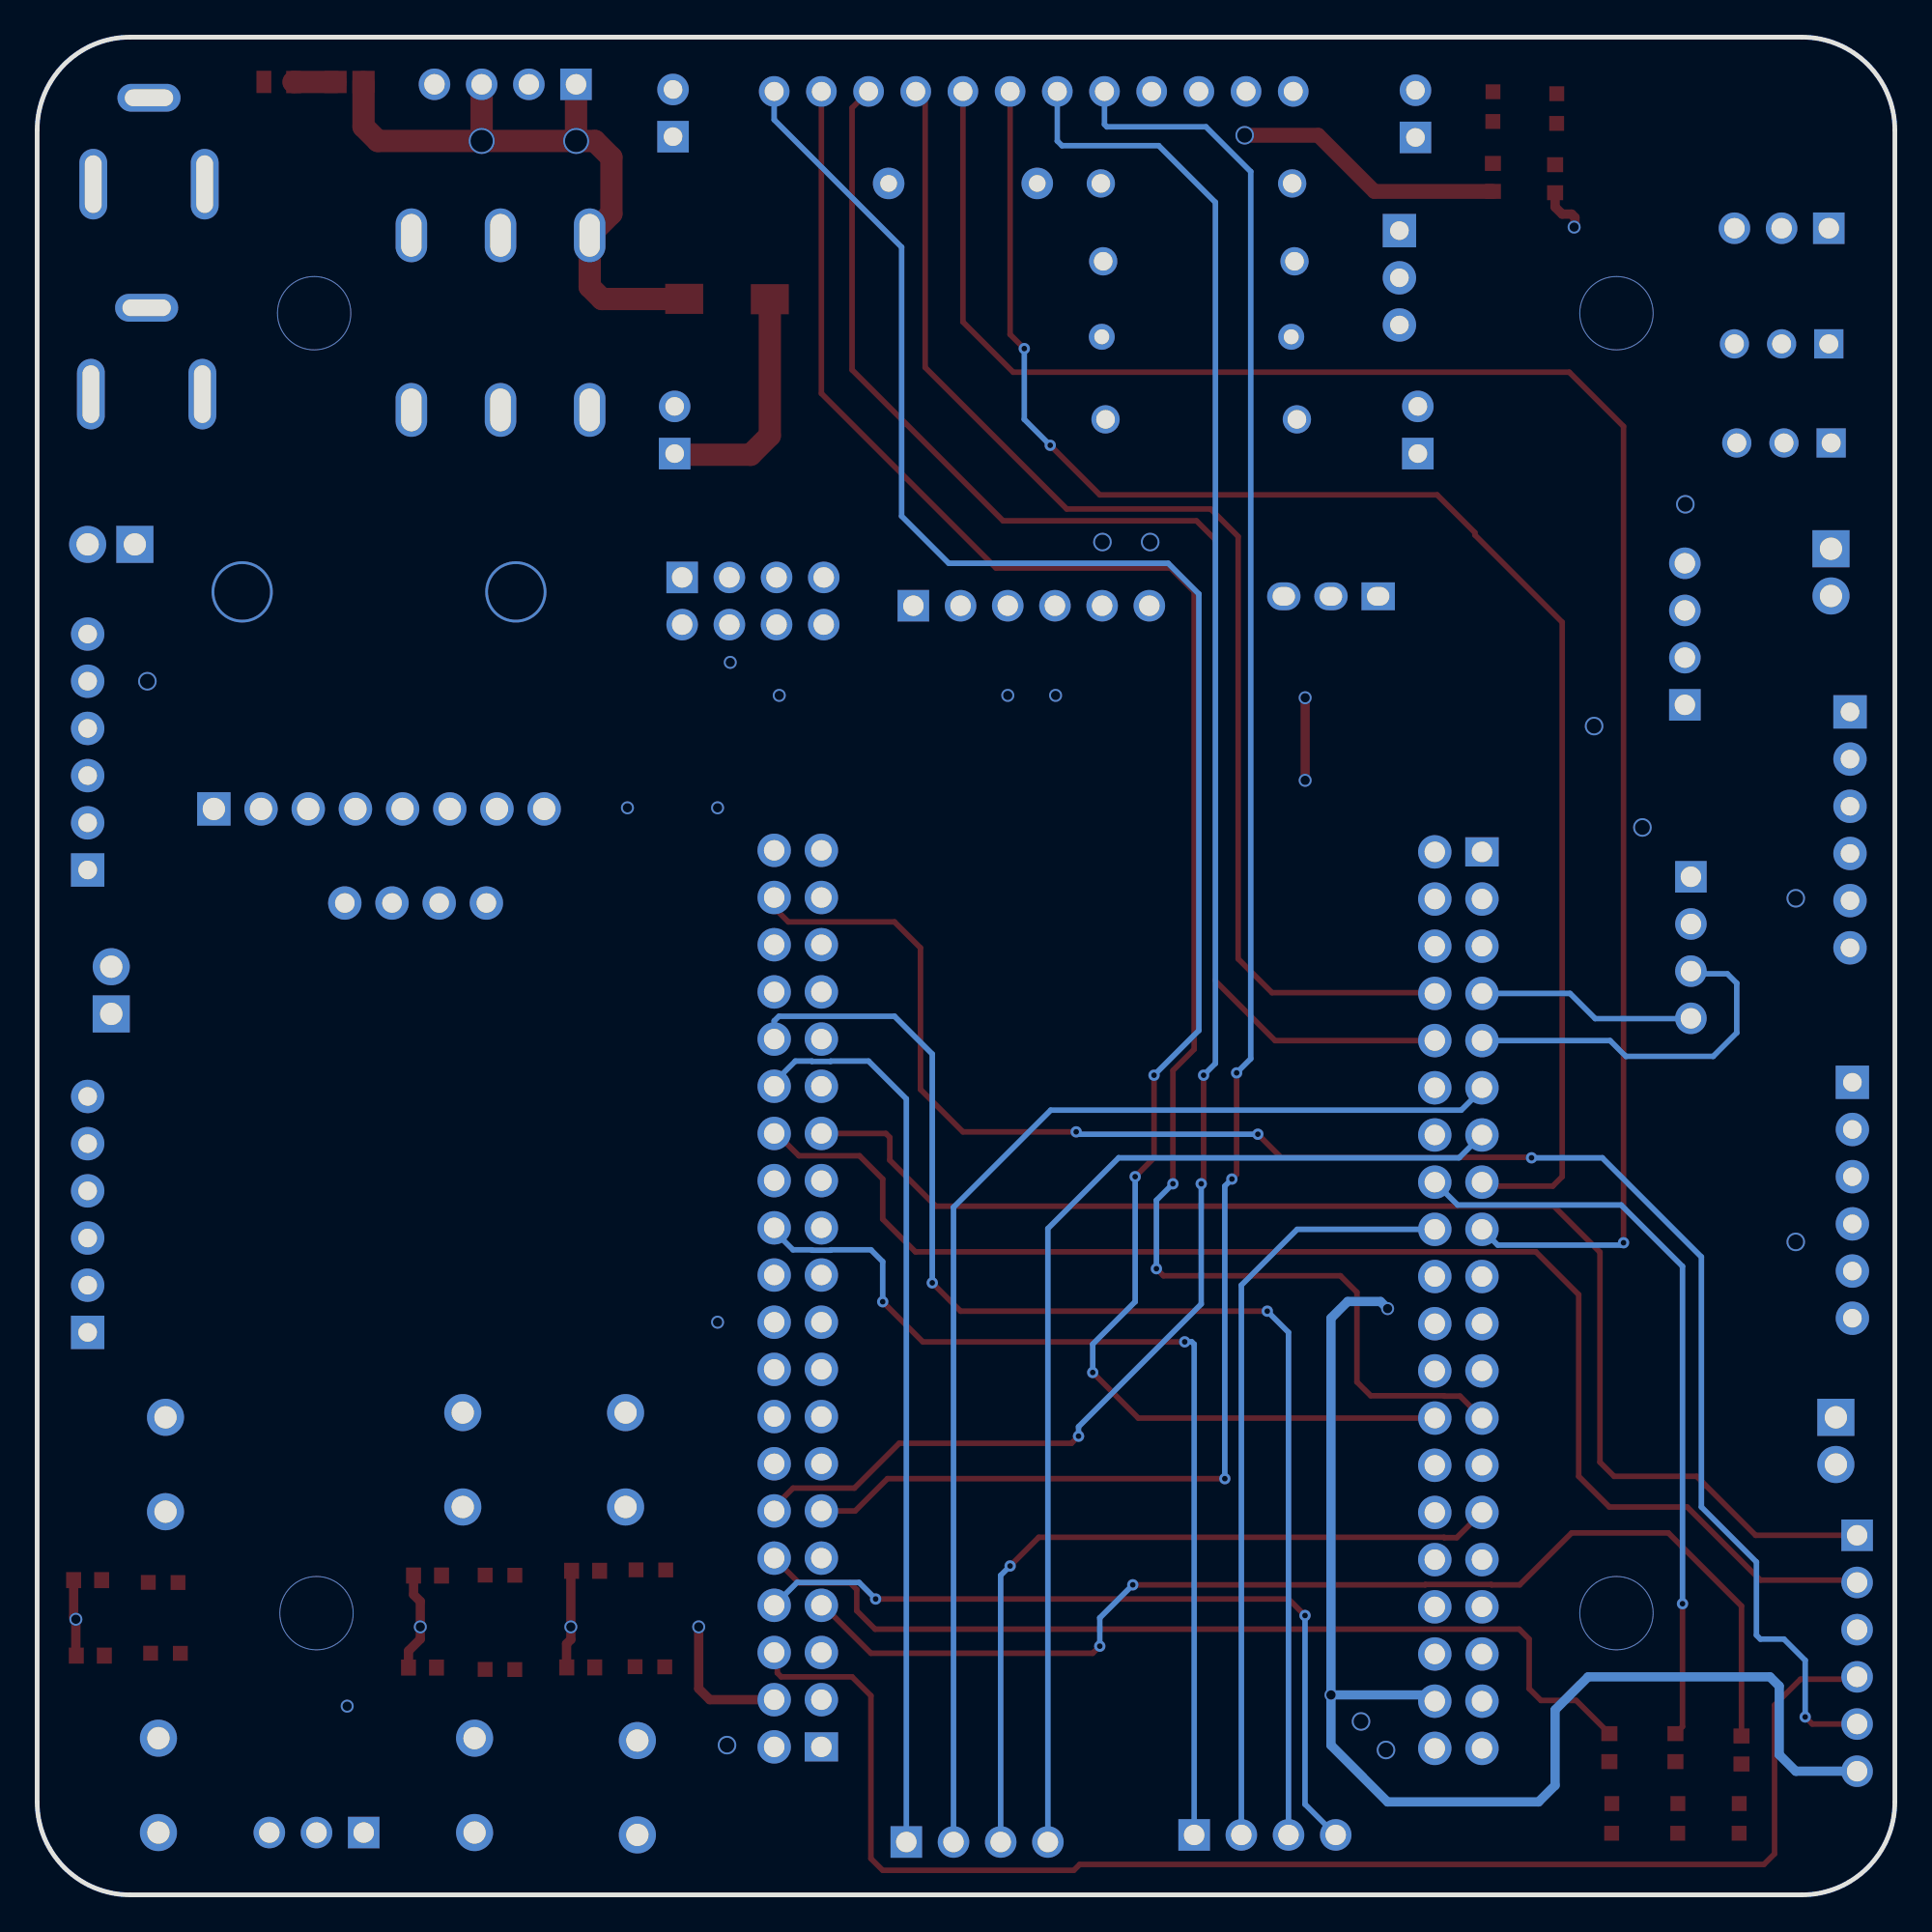
[diagram p3: board, bottom side, seen from below]

Outline 100 x 100 mm; copper layers: Top Layer, Inner1, Inner2, Bottom Layer. Coordinates in mm from the lower left corner of the outline.
Outline path: 0,95 0,5 arc(1.46,1.46) 5,0 95,0 arc(98.54,1.46) 100,5 100,95 arc(98.54,98.54) 95,100 5,100 arc(1.46,98.54) 0,95
Stack: Top Layer 0.035mm / Dielectric1 1.51mm FR4 er 4.5 / Inner1 0.035mm / Dielectric2 0.48mm PP er 4.5 / Inner2 0.035mm / Dielectric3 0.48mm PP er 4.5 / Bottom Layer 0.035mm

## Design rules (mm)
template: 自定义配置
spacing copperThickness1oz (default): track to track 0.102, other pairs 0.152 to 0.3
spacing copperThickness2oz: track to track 0.203, other pairs 0.152 to 0.3
track width copperThickness1oz (default): min 0.3, default 0.3, max 2.54
track width copperThickness2oz: min 0.203, default 0.254, max 2.54
differential pair differentialPair (default): width min 0.127, default 0.254, max 2.54; gap min 0.152, default 0.152
via viaSize (default): diameter min 0.5, default 0.61, max 10; hole min 0.3, default 0.305, max 6.3

## Placement (name value [footprint] x y rotation side)
5V电源选择1  SS12D10G5  [SW-TH_SHOU-HAN_SS12D10G4]  75.06 79.93 180 top
12V电源开关1  SS12D10G5  [SW-TH_SHOU-HAN_SS12D10G4]  75.06 89.33 0 top
6050  2.54-1*8P母环保  [HDR-TH_8P-P2.54-V-F-1]  81.6 58.45 180 top
D2  SS54  [SMA_L4.3-W2.6-LS5.0-FD]  62.87 85.9 180 top
DC1  DC005-T25  [DC-IN-TH_DC-005-20A-1]  93.98 94.41 180 top
DC2  DC005-T25  [DC-IN-TH_DC-005-20A-1]  94.11 83.11 180 top
H2  PZ254V-11-02P  [HDR-TH_2P-P2.54-V-M]  3.44 71.19 270 top
H3  PZ254V-11-02P  [HDR-TH_2P-P2.54-V-M]  96.01 72.69 0 top
H4  PZ254V-11-02P  [HDR-TH_2P-P2.54-V-M]  3.17 24.44 270 top
H5  PZ254V-11-02P  [HDR-TH_2P-P2.54-V-M]  96.01 48.69 90 top
H8  PZ254V-11-04P  [HDR-TH_4P-P2.54-V-M]  74.8 97.46 0 top
H9  PZ254V-11-06P  [HDR-TH_6P-P2.54-V-M]  46.48 69.39 180 top
INT+1  2.54-1*2P母  [HDR-TH_2P-P2.54-V-F]  65.68 78.85 90 top
INT-1  2.54-1*2P母  [HDR-TH_2P-P2.54-V-F]  65.77 95.91 90 top
K230  PZ254V-11-04P  [HDR-TH_4P-P2.54-V-M]  11.3 67.87 90 top
L298N1  2.54-1*4  [HDR-TH_4P-P2.54-V-M-1]  33.91 3.23 180 top
L298N2  2.54-1*4  [HDR-TH_4P-P2.54-V-M-1]  49.4 2.84 180 top
LED1驱动板1  LTST-C191KSKT  [LED0603-RD-YELLOW]  87 97.59 180 top
LED2电池1  LTST-C191KSKT  [LED0603-RD-YELLOW#2]  18.2 96.16 270 top
LED5V1  LTST-C191KSKT  [LED0603-RD-YELLOW#2]  21.64 96.26 270 top
LED11  LTST-C191KSKT  [LED0603-RD-YELLOW#2]  66.96 17.49 0 top
LED12  LTST-C191KSKT  [LED0603-RD-YELLOW#2]  75.09 17.21 0 top
LED15  LTST-C191KSKT  [LED0603-RD-YELLOW#2]  93.22 16.81 0 top
LED16  LTST-C191KSKT  [LED0603-RD-YELLOW#2]  67.01 12.28 0 top
LED17  LTST-C191KSKT  [LED0603-RD-YELLOW#2]  75.09 12.13 0 top
LED18  LTST-C191KSKT  [LED0603-RD-YELLOW#2]  93.09 13 0 top
LED指示红  LTST-C191KSKT  [LED0603-RD-YELLOW#2]  15.24 4.12 90 top
LED指示蓝  LTST-C191KSKT  [LED0603-RD-YELLOW#2]  8.38 4.12 90 top
LED指示黄  LTST-C191KSKT  [LED0603-RD-YELLOW#2]  11.68 4.12 90 top
OLED1  HS96L03W2C03  [OLED-TH_L27.8-W27.2-P2.54_C9900033791]  79.63 53.39 0 top
OUT+1  2.54-1*2P母  [HDR-TH_2P-P2.54-V-F]  25.68 78.85 90 top
OUT-1  2.54-1*2P母  [HDR-TH_2P-P2.54-V-F]  25.81 95.87 90 top
Q1  SS8550DTA  [TO-92-3_L4.8-W3.7-P2.54-L]  26.67 87.05 270 top
Q5  HSP3119  [TO-220-3_L10.2-W4.5-P2.54-L-1]  30.35 69.9 0 top
R10k1  10kΩ  [RES-TH_BD2.4-L6.3-P10.30-D0.6]  37.59 92.13 180 top
R10k2  10kΩ  [RES-TH_BD2.4-L6.3-P10.30-D0.6]  37.47 87.94 0 top
R10k3  10kΩ  [RES-TH_BD2.4-L6.3-P10.30-D0.6]  37.34 79.43 0 top
R41k1  1kΩ  [R0603#2]  78.99 17.19 0 top
R41k2  1kΩ  [R0603#2]  97.28 16.94 0 top
R41k3  1kΩ  [R0603#2]  70.74 12.24 0 top
R41k4  1kΩ  [R0603#2]  70.48 17.44 0 top
R41k5  1kΩ  [R0603#2]  79.26 12.23 0 top
R41k6  1kΩ  [R0603#2]  97.14 12.88 0 top
R100k1  100kΩ  [RES-TH_BD2.7-L6.2-P10.20-D0.4]  37.59 83.87 0 top
R1470  470Ω  [R0603]  83.19 97.59 0 top
R2470  470Ω  [R0603#2]  18.29 92.38 90 top
R3470  470Ω  [R0603#2]  21.64 92.45 90 top
R3471  470Ω  [R0603#2]  11.81 7.93 90 top
R3472  470Ω  [R0603#2]  8.25 7.8 90 top
R3473  470Ω  [R0603#2]  15.37 7.93 90 top
SPI1  PZ254V-12-8P  [HDR-TH_8P-P2.54-V-M-R2-C4-S2.54]  61.47 69.65 180 top
SW4  K2-1104DZ-G4SW-04  [KEY-TH_2P-L6.0-W6.0-P5.00]  68.33 23.42 270 top
SW5  K2-1104DZ-G4SW-04  [KEY-TH_2P-L6.0-W6.0-P5.00]  77.09 23.42 270 top
SW6  K2-1104DZ-G4SW-04  [KEY-TH_2P-L6.0-W6.0-P5.00]  93.09 23.16 270 top
SW7  K2-1104DZ-G4SW-04  [KEY-TH_2P-L6.0-W6.0-P5.00]  67.69 5.77 90 top
SW8  K2-1104DZ-G4SW-04  [KEY-TH_2P-L6.0-W6.0-P5.00]  76.45 5.89 90 top
SW9  K2-1104DZ-G4SW-04  [KEY-TH_2P-L6.0-W6.0-P5.00]  93.47 5.89 90 top
U1  LCKFB-TMX-MSPM0G3507  [COMM-TH_LCKFB-TMX-MSPM0G3507]  41.28 32.06 0 top
W25Q16存储器1  PZ254V-11-06P  [HDR-TH_6P-P2.54-V-M]  2.03 13 270 top
ZD1  1N4734A  [DO-41_BD2.8-L4.2-P8.00-D0.7-FD]  50.16 92.13 180 top
八路灰度传感器1  2.54-1*12P反弯针  [HDR-TH_12P-P2.54-H-M-W10.5]  46.35 97.08 180 top
电机1  XH-6AW  [CONN-TH_6P-P2.54_HCTL_XH-6AW_C2908615]  2.41 57.33 270 top
电机2  XH-6AW  [CONN-TH_6P-P2.54_HCTL_XH-6AW_C2908615]  97.28 61.52 90 top
电机3  XH-6AW  [CONN-TH_6P-P2.54_HCTL_XH-6AW_C2908615]  2.29 37.39 270 top
电机4  XH-6AW  [CONN-TH_6P-P2.54_HCTL_XH-6AW_C2908615]  97.28 36.63 90 top
红外对管检测  PZ254V-11-03P  [HDR-TH_3P-P2.54-V-M]  84.96 3.35 0 top
舵机1  舵机  [HDR-TH_3P-P2.54-V-F]  5.97 78.16 0 top
舵机2  舵机  [HDR-TH_3P-P2.54-V-F]  6.1 83.49 0 top
蓝牙1  2.54-1*4P母  [HDR-TH_4P-P2.54-V-F]  10.98 50.99 270 top
蜂鸣器  PZ254V-11-03P  [HDR-TH_3P-P2.54-V-M]  6.1 89.71 0 top

## Footprints (pads in the part's own frame, mm; a bottom-side part is the same pattern mirrored in y, then rotated)
COMM-TH_LCKFB-TMX-MSPM0G3507
  rect 1.8x1.575 hole 1.1: 1(-19.05,24.09) 41(16.51,-24.09)
  round 1.8 hole 1.1: 2(-16.51,24.09) 3(-19.05,21.549) 4(-16.51,21.549) 5(-19.05,19.009) 6(-16.51,19.009) 7(-19.05,16.47) 8(-16.51,16.47) 9(-19.05,13.93) 10(-16.51,13.93) 11(-19.05,11.389) 12(-16.51,11.389) 13(-19.05,8.85) 14(-16.51,8.85) 15(-19.05,6.309) 16(-16.51,6.309) 17(-19.05,3.769) 18(-16.51,3.769) 19(-19.05,1.23) 20(-16.51,1.23) 21(-19.05,-1.31) 22(-16.51,-1.31) 23(-19.05,-3.85) 24(-16.51,-3.85) 25(-19.05,-6.391) 26(-16.51,-6.391) 27(-19.05,-8.931) 28(-16.51,-8.931) 29(-19.05,-11.47) 30(-16.51,-11.47) 31(-19.05,-14.011) 32(-16.51,-14.011) 33(-19.05,-16.55) 34(-16.51,-16.55) 35(-19.05,-19.09) 36(-16.51,-19.09) 37(-19.05,-21.631) 38(-16.51,-21.631) 39(-19.05,-24.171) 40(-16.51,-24.171) 42(19.05,-24.09) 43(16.51,-21.549) 44(19.05,-21.549) 45(16.51,-19.009) 46(19.05,-19.009) 47(16.51,-16.47) 48(19.05,-16.47) 49(16.51,-13.93) 50(19.05,-13.93) 51(16.51,-11.389) 52(19.05,-11.389) 53(16.51,-8.85) 54(19.05,-8.85) 55(16.51,-6.309) 56(19.05,-6.309) 57(16.51,-3.769) 58(19.05,-3.769) 59(16.51,-1.23) 60(19.05,-1.23) 61(16.51,1.31) 62(19.05,1.31) 63(16.51,3.85) 64(19.05,3.85) 65(16.51,6.391) 66(19.05,6.391) 67(16.51,8.931) 68(19.05,8.931) 69(16.51,11.47) 70(19.05,11.47) 71(16.51,14.011) 72(19.05,14.011) 73(16.51,16.55) 74(19.05,16.55) 75(16.51,19.09) 76(19.05,19.09) 77(16.51,21.631) 78(19.05,21.631) 79(16.51,24.171) 80(19.05,24.171)
CONN-TH_6P-P2.54_HCTL_XH-6AW_C2908615
  rect 1.8x1.8 hole 1: 1(-6.35,0)
  round 1.8 hole 1: 2(-3.81,0) 3(-1.27,0) 4(1.27,0) 5(3.81,0) 6(6.35,0)
DC-IN-TH_DC-005-20A-1
  oval 1.5x3.8 hole 0.9x3.1: 1(3,2.325) 2(-3,2.325)
  oval 3.4x1.5 hole 2.6x0.9: 3(0,-2.325)
DO-41_BD2.8-L4.2-P8.00-D0.7-FD
  round 1.7 hole 0.9: 1(-4,0) 2(4,0)
HDR-TH_2P-P2.54-V-F
  rect 1.7x1.7 hole 1: 1(-1.27,0)
  round 1.7 hole 1: 2(1.27,0)
HDR-TH_2P-P2.54-V-M
  rect 2x2 hole 1.2: 1(-1.27,0)
  round 2 hole 1.2: 2(1.27,0)
HDR-TH_3P-P2.54-V-F
  rect 1.575x1.575 hole 1.02: 1(-2.54,0)
  round 1.575 hole 1.02: 2(0,0) 3(2.54,0)
HDR-TH_3P-P2.54-V-M
  rect 1.7x1.7 hole 1.1: 1(-2.54,0)
  round 1.7 hole 1.1: 2(0,0) 3(2.54,0)
HDR-TH_4P-P2.54-V-F
  rect 1.7x1.7 hole 1.1: 1(-3.81,0)
  round 1.7 hole 1.1: 2(-1.27,0) 3(1.27,0) 4(3.81,0)
HDR-TH_4P-P2.54-V-M
  rect 1.7x1.7 hole 1.1: 1(-3.81,0)
  round 1.7 hole 1.1: 2(-1.27,0) 3(1.27,0) 4(3.81,0)
HDR-TH_4P-P2.54-V-M-1
  rect 1.7x1.7 hole 1.1: 1(-3.81,0)
  round 1.7 hole 1.1: 2(-1.27,0) 3(1.27,0) 4(3.81,0)
HDR-TH_6P-P2.54-V-M
  rect 1.7x1.7 hole 1.1: 1(-6.35,0)
  round 1.7 hole 1.1: 2(-3.81,0) 3(-1.27,0) 4(1.27,0) 5(3.81,0) 6(6.35,0)
HDR-TH_8P-P2.54-V-F-1
  rect 1.8x1.8 hole 1.2: 1(-8.89,0)
  round 1.8 hole 1.2: 2(-6.35,0) 3(-3.81,0) 4(-1.27,0) 5(1.27,0) 6(3.81,0) 7(6.35,0) 8(8.89,0)
HDR-TH_8P-P2.54-V-M-R2-C4-S2.54
  rect 1.7x1.7 hole 1.1: 1(-3.81,-1.27)
  round 1.7 hole 1.1: 2(-3.81,1.27) 3(-1.27,-1.27) 4(-1.27,1.27) 5(1.27,-1.27) 6(1.27,1.27) 7(3.81,-1.27) 8(3.81,1.27)
HDR-TH_12P-P2.54-H-M-W10.5
  round 1.65 hole 1.02: 1(-13.97,0) 2(-11.43,0) 3(-8.89,0) 4(-6.35,0) 5(-3.81,0) 6(-1.27,0) 7(1.27,0) 8(3.81,0) 9(6.35,0) 10(8.89,0) 11(11.43,0) 12(13.97,0)
KEY-TH_2P-L6.0-W6.0-P5.00
  round 2 hole 1.2: 1(-2.54,0) 2(2.54,0)
LED0603-RD-YELLOW
  rect 0.8x1.2 smd: 1(-0.799,-0.004) 2(0.799,0.004)
LED0603-RD-YELLOW#2
  rect 0.8x0.8 smd: 1(-0.799,-0.004) 2(0.799,0.004)
OLED-TH_L27.8-W27.2-P2.54_C9900033791
  round 1.8 hole 1.05: 1(-3.81,0) 2(-1.27,0) 3(1.27,0) 4(3.81,0)
R0603
  rect 1.2x1.2 smd: 1(-0.753,0) 2(0.753,0)
R0603#2
  rect 0.806x0.864 smd: 1(-0.753,0) 2(0.753,0)
RES-TH_BD2.4-L6.3-P10.30-D0.6
  round 1.524 hole 1: 1(-5.15,0) 2(5.15,0)
RES-TH_BD2.7-L6.2-P10.20-D0.4
  round 1.4 hole 0.8: 1(-5.1,0) 2(5.1,0)
SMA_L4.3-W2.6-LS5.0-FD
  rect 2.046x1.62 smd: 1(-2.304,-0.009) 2(2.304,0.009)
SW-TH_SHOU-HAN_SS12D10G4
  oval 1.7x2.9 hole 1.1x2.3: 1(-4.8,0) 2(0,0) 3(4.8,0)
TO-92-3_L4.8-W3.7-P2.54-L
  rect 1.8x1.8 hole 1: 1(-2.54,0)
  round 1.8 hole 1: 2(0,0) 3(2.54,0)
TO-220-3_L10.2-W4.5-P2.54-L-1
  rect 1.8x1.5 hole 1.2x1: 1(-2.54,0)
  oval 1.8x1.5 hole 1.2x1: 2(0,0) 3(2.54,0)

## Nets
As in the schematic, except:
PA02: U1.61

Pads without a net: 12V电源开关1 3; 6050 2 3 4; INT+1 2; INT-1 2; OUT+1 2; OUT-1 2

## Via types
v1: diameter 3.3, hole 3, Top Layer to Bottom Layer, 2 vias
v2: diameter 4, hole 3.9, Top Layer to Bottom Layer, 4 vias
v3: diameter 1, hole 0.8, Top Layer to Bottom Layer, 12 vias
v4: diameter 1.4, hole 1.2, Top Layer to Bottom Layer, 2 vias
v5: diameter 0.7, hole 0.5, Top Layer to Bottom Layer, 17 vias
v6: diameter 0.61, hole 0.305, Top Layer to Bottom Layer, 28 vias

## Routing (per net, layer and track width the routed paths; a pad name or vN(x,y) marks a point on that pad's centre or on a via; arc(x,y) is an arc through that point)
3V3: length 366.2
  Top Layer w0.5: 60.32,10.51 63.79,10.51 64.39,11.1 v5(64.39,14.43) ; 79.74,17.19 79.74,16.16 79.38,15.8 v5(79.38,14.43) 79.38,13.77 80.01,13.13 R41k5.2 ; R41k4.2 71.27,17.4 v5(71.27,14.43) 71.27,13.74 71.5,13.51 71.5,12.25 R41k3.2 ; R41k6.2 97.92,12.9 v5(97.92,14.84) 98.04,14.95 R41k2.2 ; v5(17.26,89.78) 17.22,89.82 17.22,90.3 17.4,90.47 17.91,90.47 18.29,90.86 R2470.1 ; v5(31.74,60) v5(31.74,64.44)
  Inner1 w0.5: v5(68.22,58.52) 68.22,56.54 69.47,55.3 77.98,55.3 78.36,54.92 78.36,53.39 ; v5(68.22,58.52) 72.65,58.52 6050.8 ; v5(68.22,58.52) v5(63.37,58.52) ; v5(62.69,66.34) 64.9,66.34 65.15,66.6 65.15,68.25 65.28,68.38 ; v5(62.69,66.34) 62.69,68.33 62.74,68.38 ; v5(62.69,66.34) 60.45,66.34 60.05,65.95 v5(60.05,64.57) ; 83.36,10.16 83.36,8.74 83.18,8.56 82.8,8.56 82.42,8.18 红外对管检测.1 ; 83.36,10.16 88.21,10.16 89.28,11.23 89.28,14.66 89.46,14.84 v5(97.92,14.84) ; 83.36,10.16 82.98,10.16 82.55,10.59 82.55,12.5 80.62,14.43 v5(79.38,14.43) v5(71.27,14.43) v5(64.39,14.43) 64.39,29.81 v5(63.37,30.83) ; 60.32,30.83 v5(63.37,30.83) ; v5(63.37,30.83) v5(63.37,58.52) ; v5(63.37,58.52) 63.37,61.77 60.58,64.57 v5(60.05,64.57) ; U1.22 27.01,30.74 27.31,31.04 v5(27.31,31.56) 27.31,56.44 30.86,60 v5(31.74,60) 39.88,60 44.45,64.57 v5(45.18,64.57) ; v5(60.05,64.57) v5(47.75,64.57) ; v5(47.75,64.57) H9.3 ; v5(47.75,64.57) v5(45.18,64.57) ; v5(45.18,64.57) 45.18,69.36 H9.4 ; v5(31.74,64.44) 31.81,64.5 31.81,64.51 31.43,64.88 21.15,64.88 18.99,67.04 18.99,88.76 17.97,89.78 v5(17.26,89.78) 13.4,89.78 11.37,91.81 4,91.81 3.62,91.43 3.62,89.78 蜂鸣器.1
  Bottom Layer w0.5: v5(30.35,10.76) 30.35,8.05 27.31,5 19.18,5 18.29,5.89 18.29,9.96 16.51,11.74 6.72,11.74 6.22,11.24 6.22,7.54 5.33,6.66 W25Q16存储器1.6 ; v5(30.35,10.76) 25.1,10.76 U1.38 ; v5(30.35,10.76) 30.35,31.04 29.45,31.94 27.69,31.94 v5(27.31,31.56)
  vias: v5(83.31,10.16)
5V: length 443.5
  Top Layer w0.8: v3(35,94.72) 31.04,94.72 28.02,91.7 R3470.1
  Inner1 w0.8: v3(94.07,65.33) 70.23,65.33 69.28,66.28 69.28,72.82 ; v3(94.07,65.33) 97.28,65.33 ; v3(94.07,65.33) 94.07,57.03 90.55,53.52 90.55,41.07 91.31,40.31 97.16,40.31 电机4.5 ; v3(13.59,57.46) 13.59,54.98 13.41,54.8 蓝牙1.1 ; v3(13.59,57.46) 7.11,57.46 5.33,55.68 v3(5.33,53.64) ; v3(13.59,57.46) 13.59,61.65 14.86,62.92 v3(16.19,62.92) ; v3(16.19,62.92) 16.19,71.62 12.95,74.85 v3(11.28,74.85) ; v3(16.19,62.92) 35.81,62.92 36.96,64.06 36.96,71.17 38.61,72.82 v3(40.09,72.82) ; 电机3.5 4.57,33.58 5.33,34.34 v3(5.33,35.15) ; v3(27.39,7.8) 27.94,7.8 28.74,8.59 v3(28.74,9.33) ; v3(27.39,7.8) 24.85,7.8 U1.40 ; v3(27.39,7.8) 27.39,5.6 26.92,5.13 20.19,5.13 18.54,6.78 18.54,9.83 16.89,11.48 11.68,11.48 9.4,13.77 9.4,33.96 8.21,35.15 v3(5.33,35.15) ; 60.32,7.97 60.42,8.06 v3(62.87,8.06) ; H9.6 40.09,69.44 v3(40.09,72.82) ; H9.5 42.66,69.41 v3(42.66,72.82) ; v3(40.09,72.82) v3(42.66,72.82) ; 八路灰度传感器1.11 34.93,94.9 35,94.83 v3(35,94.72) 35.31,94.41 49.6,94.41 50.29,93.72 50.29,85.52 52.83,82.98 74.42,82.98 75.06,82.35 5V电源选择1.2 75.06,74.22 73.66,72.82 69.28,72.82 ; v3(62.87,8.06) 62.87,27.36 61.94,28.29 60.32,28.29 ; v3(62.87,8.06) 62.87,6.15 62.1,5.38 53.21,5.38 49.26,9.33 v3(28.74,9.33) ; v3(5.33,53.64) v3(5.33,35.15) ; v3(5.33,53.64) 5.21,53.52 电机1.5 ; 69.28,72.82 v3(42.66,72.82) ; v3(28.74,9.33) 28.74,27.45 28.07,28.12 24.85,28.12 U1.24 ; v3(11.28,74.85) 6.73,74.85 5.97,75.62 舵机1.2 ; v3(11.28,74.85) 11.28,80.09 10.41,80.95 6.6,80.95 6.1,81.46 舵机2.2
5V1: length 11.7
  Inner1 w0.8: DC2.1 83.78,80.78 82.8,79.81 79.98,79.81 5V电源选择1.1
5V2: length 67.5
  Inner1 w0.8: 23.88,74.9 22.31,74.9 21.21,76 21.21,87.55 23.24,89.59 Q1.1 28.7,89.59 31.24,92.13 R10k1.2 36.32,92.13 37.85,90.6 37.85,85.27 39.24,83.87 R100k1.2 ; 23.88,74.9 23.88,77.15 24.31,77.58 OUT+1.1 ; 23.88,74.9 23.88,68.25 25.27,66.85 31.88,66.85 32.89,67.87 Q5.3
5V3: length 49.1
  Inner1 w0.8: Q5.2 30.23,70.03 30.23,74.09 30.86,74.73 69.09,74.73 70.26,75.9 5V电源选择1.3
12V: length 35.3
  Top Layer w1.2: H8.1 70.99,94.42 v4(70.99,94.41) ; v4(76.07,94.41) 81.66,94.41 82.43,95.18 R1470.1 ; v4(76.07,94.41) v4(70.99,94.41) ; v4(76.07,94.41) H8.3 ; v4(70.99,94.41) 69.98,94.41 69.09,93.52 69.09,90.5 12V电源开关1.1 70.26,86.56 69.6,85.9 65.18,85.9 D2.1
V12: length 18.5
  Inner1 w1.2: 12V电源开关1.2 75.06,91.75 75.4,92.09 DC1.1
(no net):
  vias: v1(74.23,70.14) v1(88.96,70.14) v2(14.99,85.14) v2(14.99,15.16) v2(84.96,15.16) v2(85.09,85.14)
1: length 7.7
  Inner1 w0.8: ZD1.2 R10k1.1 42.74,88.06 R10k2.2
2: length 6
  Inner1 w0.8: R10k2.1 31.43,87.05 Q1.2
3: length 23.6
  Inner1 w0.8: Q5.1 27.81,77.78 29.46,79.43 R10k3.1 32.49,79.73 R100k1.1 31.86,84.51 Q1.3
PA07: length 51.1
  Top Layer w0.3: 60.32,18.13 58.99,16.79 56.23,16.79 55.88,16.43 55.88,15.29 54.89,14.3 20.22,14.3 19.69,13.77 19.69,11.1 19.05,10.47 17.15,10.47 R3473.2
PA08: length 11.8
  Bottom Layer w0.3: 蓝牙1.4 10.99,47.17 16.13,47.17 17.49,48.52 22.22,48.52
PA09: length 20
  Bottom Layer w0.3: 蓝牙1.3 10.84,49.58 9.02,49.58 8.51,49.07 8.51,46.41 9.78,45.14 14.48,45.14 15.33,45.98 22.22,45.98
PA12: length 41.7
  Top Layer w0.3: 22.22,20.58 23.58,19.23 24.25,19.23 24.27,19.25 46.08,19.25 v6(47.62,17.7)
  Bottom Layer w0.3: L298N2.3 48.13,17.2 v6(47.62,17.7)
PA15: length 48.7
  Bottom Layer w0.3: 60.32,43.53 60.32,43.74 59.18,44.88 58.3,44.88 58.28,44.86 57.29,44.86 57.27,44.88 55.25,44.88 53.21,42.85 L298N2.1
PA16: length 72.1
  Top Layer w0.3: W25Q16存储器1.1 7.49,19.35 10.67,22.53 15.11,22.53 15.88,23.29 15.88,34.59 18.35,37.07 51.63,37.07 54.1,39.55 54.1,40.77 54.31,40.99 U1.67
PA17: length 75.3
  Top Layer w0.3: 60.32,40.99 60.2,40.99 59,39.78 55.73,39.78 54.48,38.53 54.48,36.37 52.72,34.61 19.32,34.61 17.02,32.31 17.02,22.53 15.37,20.88 11.18,20.88 7.24,16.94 2.16,16.94 W25Q16存储器1.2
PA18: length 77.8
  Top Layer w0.3: 2.03,11.74 2.16,11.61 5.08,11.61 6.48,10.21 6.48,2.21 7.05,1.64 43.88,1.64 44.2,1.32 54.48,1.32 55.12,1.96 55.12,10.72 56.13,11.74 59.94,11.74 60.16,11.95 60.16,12.88 60.32,13.05
PA21: length 53
  Top Layer w0.3: v6(54.48,31.93) 52.32,29.77 v6(38.23,29.77)
  Bottom Layer w0.3: 60.32,35.91 60.32,35.74 59.31,34.72 58.3,34.72 58.28,34.7 57.29,34.7 57.27,34.72 55.12,34.72 54.48,34.09 v6(54.48,31.93) ; v6(38.23,29.77) 37.85,29.77 37.72,29.64 L298N1.1
PA22: length 70.1
  Top Layer w0.3: v6(51.82,32.94) 50.29,31.42 v6(33.78,31.42)
  Bottom Layer w0.3: 32.64,3.23 32.64,30.28 v6(33.78,31.42) ; 60.32,46.07 60.32,47.04 60.07,47.3 53.85,47.3 51.82,45.26 v6(51.82,32.94)
PA26: length 93.5
  Top Layer w0.3: 60.32,53.69 60.32,53.14 59.56,52.38 53.85,52.38 52.45,50.98 52.45,43.36 50.16,41.07 v6(44.07,41.07) ; v6(34.29,40.94) 33.05,39.7 19.59,39.7 v6(19.56,39.67) ; W25Q16存储器1.5 4.44,9.19 v6(4.83,9.58)
  Bottom Layer w0.3: v6(4.83,9.58) 4.83,12.62 5.97,13.77 7.24,13.77 7.45,13.98 7.45,17.92 10.41,20.88 10.41,34.34 15.75,39.67 v6(19.56,39.67) ; v6(34.29,40.94) 43.94,40.94 v6(44.07,41.07)
PB00: length 104.1
  Top Layer w0.3: v6(35.69,38.53) 35.43,38.79 v6(35.43,44.25) ; v6(36.07,22.4) 54.23,22.4 55.97,20.67 U1.51
  Bottom Layer w0.3: v6(36.07,22.4) 36.07,38.15 v6(35.69,38.53) ; v6(35.43,44.25) 34.67,45.01 34.67,92.76 37.08,95.17 42.42,95.17 42.54,95.3 八路灰度传感器1.8
PB01: length 100.2
  Top Layer w0.3: v6(37.21,44.12) 37.21,38.41 v6(37.34,38.28) ; 60.32,20.67 60.32,20.88 59.31,21.9 56.01,21.9 53.59,24.31 44.32,24.31 v6(43.94,24.69)
  Bottom Layer w0.3: 八路灰度传感器1.7 45.09,94.41 44.83,94.16 39.62,94.16 36.58,91.11 36.58,44.75 v6(37.21,44.12) ; v6(37.34,38.28) 37.34,31.8 43.94,25.2 v6(43.94,24.69)
PB02: length 86
  Top Layer w0.3: 22.22,38.36 22.01,38.15 18.42,38.15 17.91,38.66 17.91,68.5 22.61,73.2 22.61,73.33 24.64,75.36 42.8,75.36 v6(45.47,78.03) ; 八路灰度传感器1.6 47.62,84 v6(46.86,83.24)
  Bottom Layer w0.3: v6(45.47,78.03) 46.86,79.43 v6(46.86,83.24)
PB03: length 102.3
  Top Layer w0.3: 八路灰度传感器1.5 50.16,84.67 47.46,81.97 17.53,81.97 14.61,79.05 v6(14.61,35.1)
  Bottom Layer w0.3: 22.22,35.82 21.38,34.98 14.73,34.98 v6(14.61,35.1)
PB04: length 69.8
  Top Layer w0.3: U1.8 24.81,48.56 33.53,48.56 35.35,50.39 35.35,73.12 36.83,74.6 44.58,74.6 52.2,82.22 52.2,96.57 八路灰度传感器1.4
PB05: length 75.6
  Top Layer w0.3: U1.10 33.36,45.98 36.58,49.2 36.58,72.95 37.59,73.97 48.01,73.97 56.13,82.09 56.13,96.19 八路灰度传感器1.3
PB06: length 101.7
  Top Layer w0.3: v6(39.75,33.71) 39.37,33.33 29.84,33.33 28.96,32.44 28.96,27.61 28.21,26.87 24.27,26.87 24.25,26.85 23.41,26.85 22.22,25.66 ; 八路灰度传感器1.2 57.78,80.82 48.39,71.42 38.99,71.42 37.72,70.16 37.72,45.52 38.86,44.37 v6(38.86,38.28)
  Bottom Layer w0.3: v6(38.86,38.28) 39.75,37.39 v6(39.75,33.71)
PB07: length 107.1
  Top Layer w0.3: U1.26 40.73,25.66 v6(43.18,28.12) ; v6(40.89,38.66) 39.88,39.67 v6(39.88,44.12)
  Bottom Layer w0.3: 八路灰度传感器1.1 60.32,95.56 53.47,88.7 53.47,74.22 50.93,71.68 39.12,71.68 37.47,70.03 37.47,46.53 v6(39.88,44.12) ; v6(40.89,38.66) 40.89,31.93 43.18,29.64 v6(43.18,28.12)
PB11: length 62.8
  Top Layer w0.3: v6(41.02,16.69) 25.28,16.69 25.26,16.71 21.73,16.71 21.71,16.69 20.19,16.69 17.4,19.48 12.19,19.48 8.25,15.54 R3472.2 ; U1.47 57.7,15.59 55.12,13 43.18,13 v6(42.8,13.39)
  Bottom Layer w0.3: v6(41.02,16.69) 42.8,14.91 v6(42.8,13.39)
PB12: length 40.5
  Top Layer w0.3: R3471.2 11.43,9.06 v6(11.43,15.67)
  Bottom Layer w0.3: v6(11.43,15.67) 11.43,33.83 14.73,37.14 23.54,37.14 U1.16
PB13: length 41.3
  Bottom Layer w0.3: U1.18 32.17,35.82 35.18,32.82 L298N1.2
PB14: length 42.3
  Top Layer w0.3: v6(31.75,15.04) 32.64,15.93 v6(54.86,15.93)
  Bottom Layer w0.3: v6(31.75,15.04) 31.75,4.88 L298N1.4 ; v6(54.86,15.93) 55.75,16.81 59.1,16.81 60.32,15.59
PB15: length 65.3
  Bottom Layer w0.3: 22.22,43.44 22.22,43.36 23.34,42.24 45.44,42.24 50.67,37.01 L298N2.2
PB16: length 58.5
  Bottom Layer w0.3: L298N2.4 45.59,35.86 41.78,39.67 23.45,39.67 22.22,40.9
$1N2893: length 2.3
  Top Layer w1.2: LED1驱动板1.2 86.19,97.59 R1470.2
$1N2928: length 12.9
  Top Layer w1.2: D2.2 60.56,78.56 61.59,77.52 65.62,77.52 INT+1.1

## Text on the board
Top Silkscreen Layer: INT4 | INT3 | INT2 | INT1 | LM2596S | MPU6050

# Board PCB5
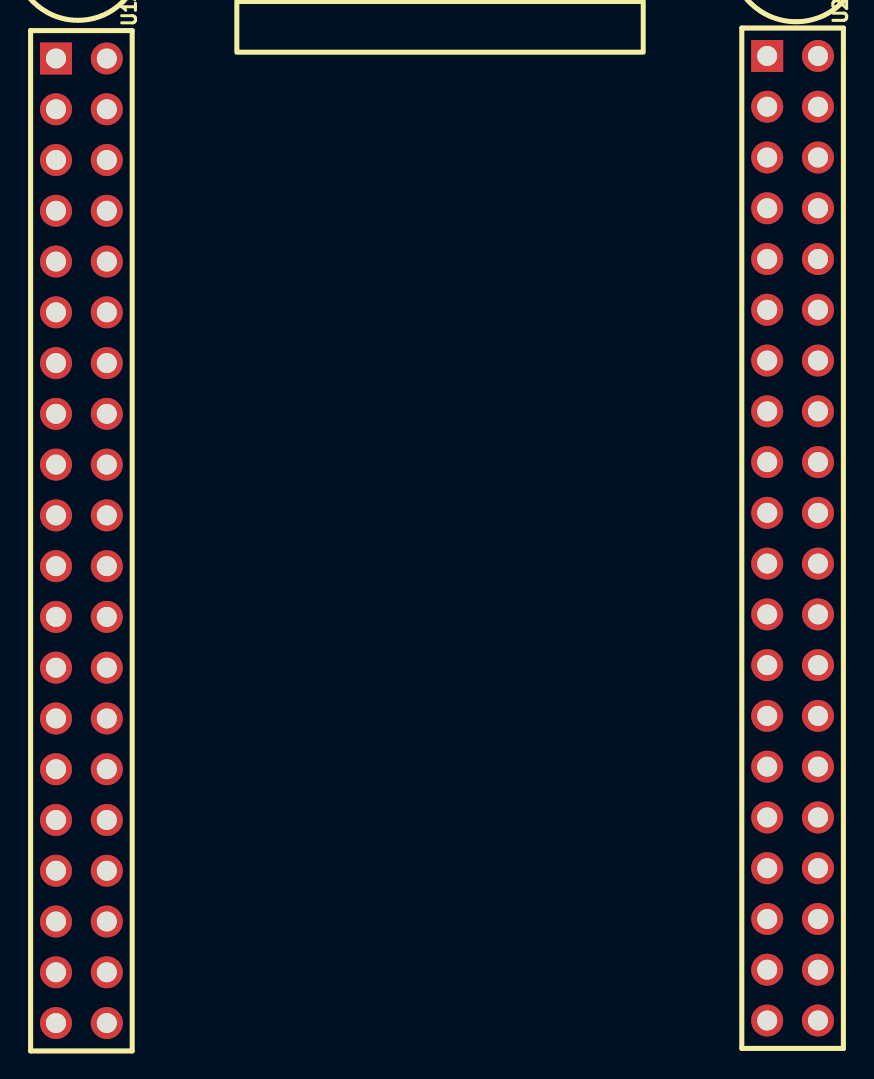
[diagram p4: board, top side]
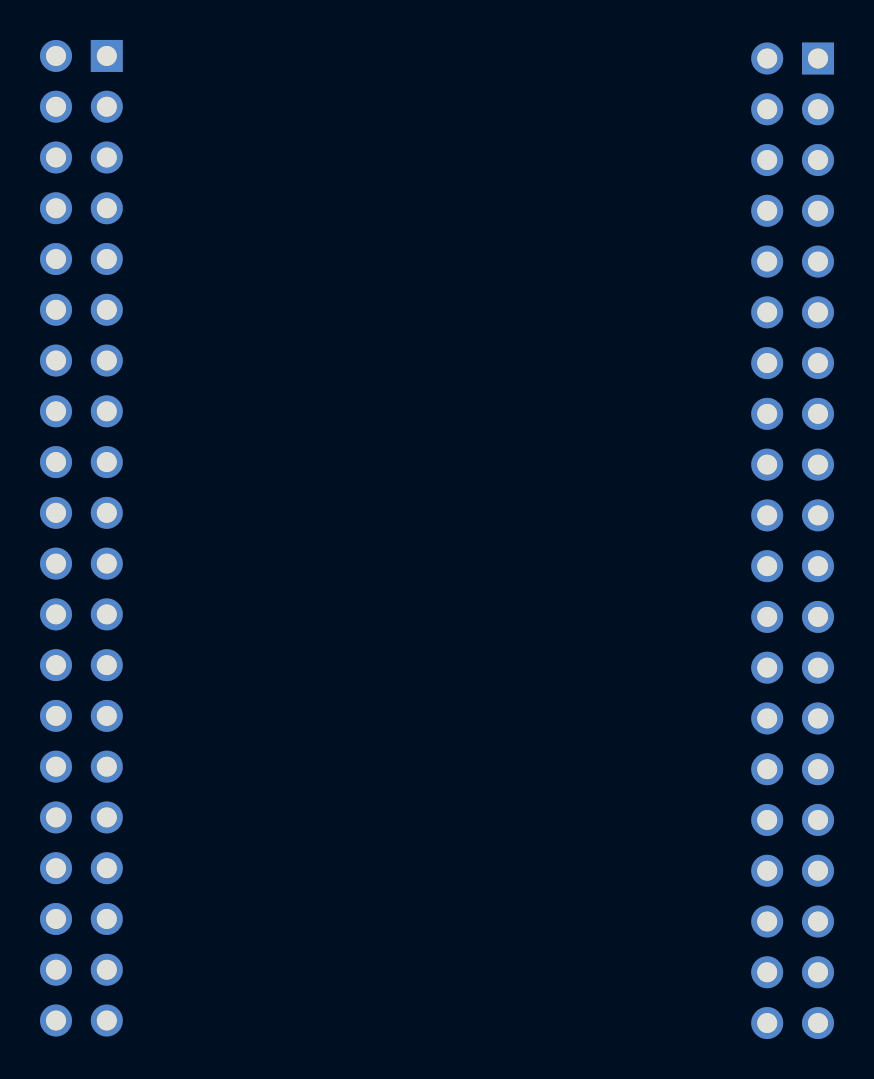
[diagram p5: board, bottom side, seen from below]

No outline. copper layers: Top Layer, Bottom Layer. Coordinates in mm from the lowest, leftmost part position.
Stack: Top Layer 0.035mm / Dielectric1 1.51mm FR4 er 4.5 / Bottom Layer 0.035mm

## Design rules (mm)
template: JLCPCB Capability(Two Layers Board)
spacing copperThickness1oz (default): track to track 0.102, other pairs 0.152 to 0.3
spacing copperThickness2oz: track to track 0.203, other pairs 0.152 to 0.3
track width copperThickness1oz (default): min 0.127, default 0.254, max 2.54
track width copperThickness2oz: min 0.203, default 0.254, max 2.54
differential pair differentialPair (default): width min 0.127, default 0.254, max 2.54; gap min 0.152, default 0.152
via viaSize (default): diameter min 0.5, default 0.61, max 10; hole min 0.3, default 0.305, max 6.3

## Placement (name value [footprint] x y rotation side)
U1左  2.54-2*20  [HDR-TH_40P-P2.54-V-F-R2-C20-S2.54]  0 0 270 top
U2右  2.54-2*20  [HDR-TH_40P-P2.54-V-F-R2-C20-S2.54]  35.56 0.13 270 top

## Footprints (pads in the part's own frame, mm; a bottom-side part is the same pattern mirrored in y, then rotated)
HDR-TH_40P-P2.54-V-F-R2-C20-S2.54
  rect 1.6x1.6 hole 1: 1(-24.13,-1.27)
  round 1.6 hole 1: 2(-24.13,1.27) 3(-21.59,-1.27) 4(-21.59,1.27) 5(-19.05,-1.27) 6(-19.05,1.27) 7(-16.51,-1.27) 8(-16.51,1.27) 9(-13.97,-1.27) 10(-13.97,1.27) 11(-11.43,-1.27) 12(-11.43,1.27) 13(-8.89,-1.27) 14(-8.89,1.27) 15(-6.35,-1.27) 16(-6.35,1.27) 17(-3.81,-1.27) 18(-3.81,1.27) 19(-1.27,-1.27) 20(-1.27,1.27) 21(1.27,-1.27) 22(1.27,1.27) 23(3.81,-1.27) 24(3.81,1.27) 25(6.35,-1.27) 26(6.35,1.27) 27(8.89,-1.27) 28(8.89,1.27) 29(11.43,-1.27) 30(11.43,1.27) 31(13.97,-1.27) 32(13.97,1.27) 33(16.51,-1.27) 34(16.51,1.27) 35(19.05,-1.27) 36(19.05,1.27) 37(21.59,-1.27) 38(21.59,1.27) 39(24.13,-1.27) 40(24.13,1.27)

## Nets
As in the schematic, except:
3.3V: U1左.22 U1左.38 U2右.22 U2右.38
5V: U1左.24 U1左.40 U2右.24 U2右.40
GND: U1左.1 U1左.2 U1左.21 U1左.23 U1左.37 U1左.39 U2右.1 U2右.2 U2右.21 U2右.23 U2右.28 U2右.37 U2右.39
